# EAGLE design draft11_proto (EAGLE 6.3)
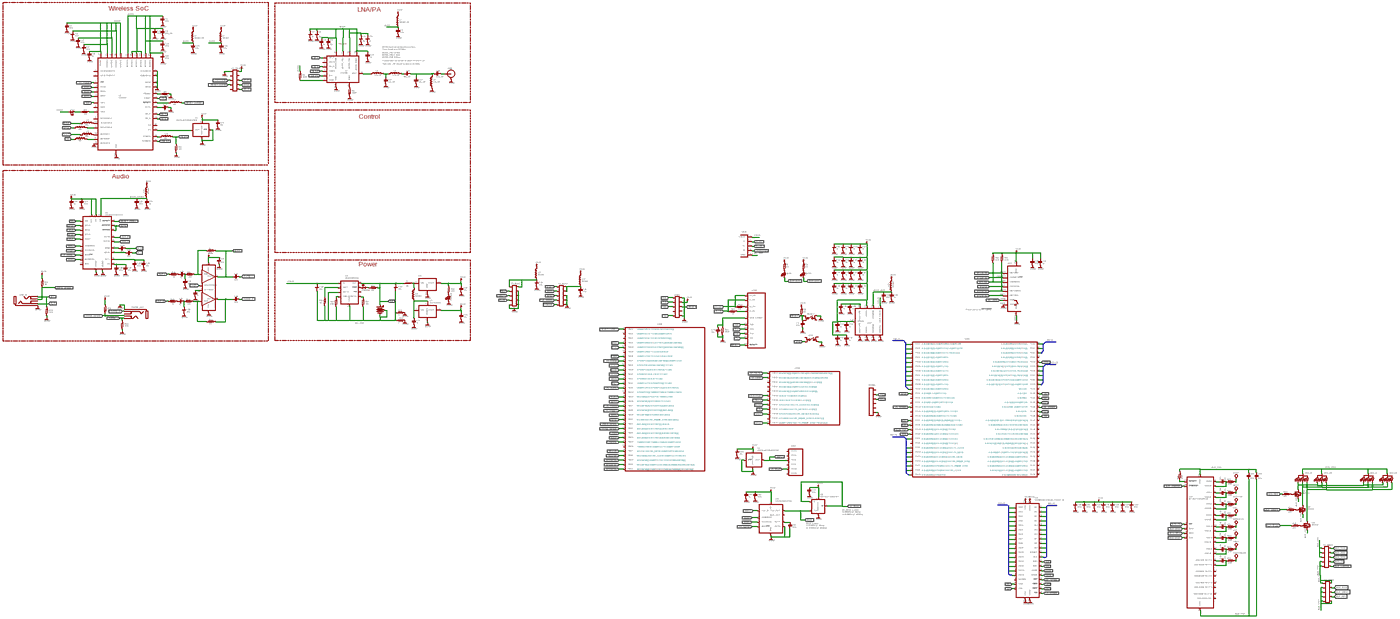
[diagram p0: schematic, sheet 1, overview]
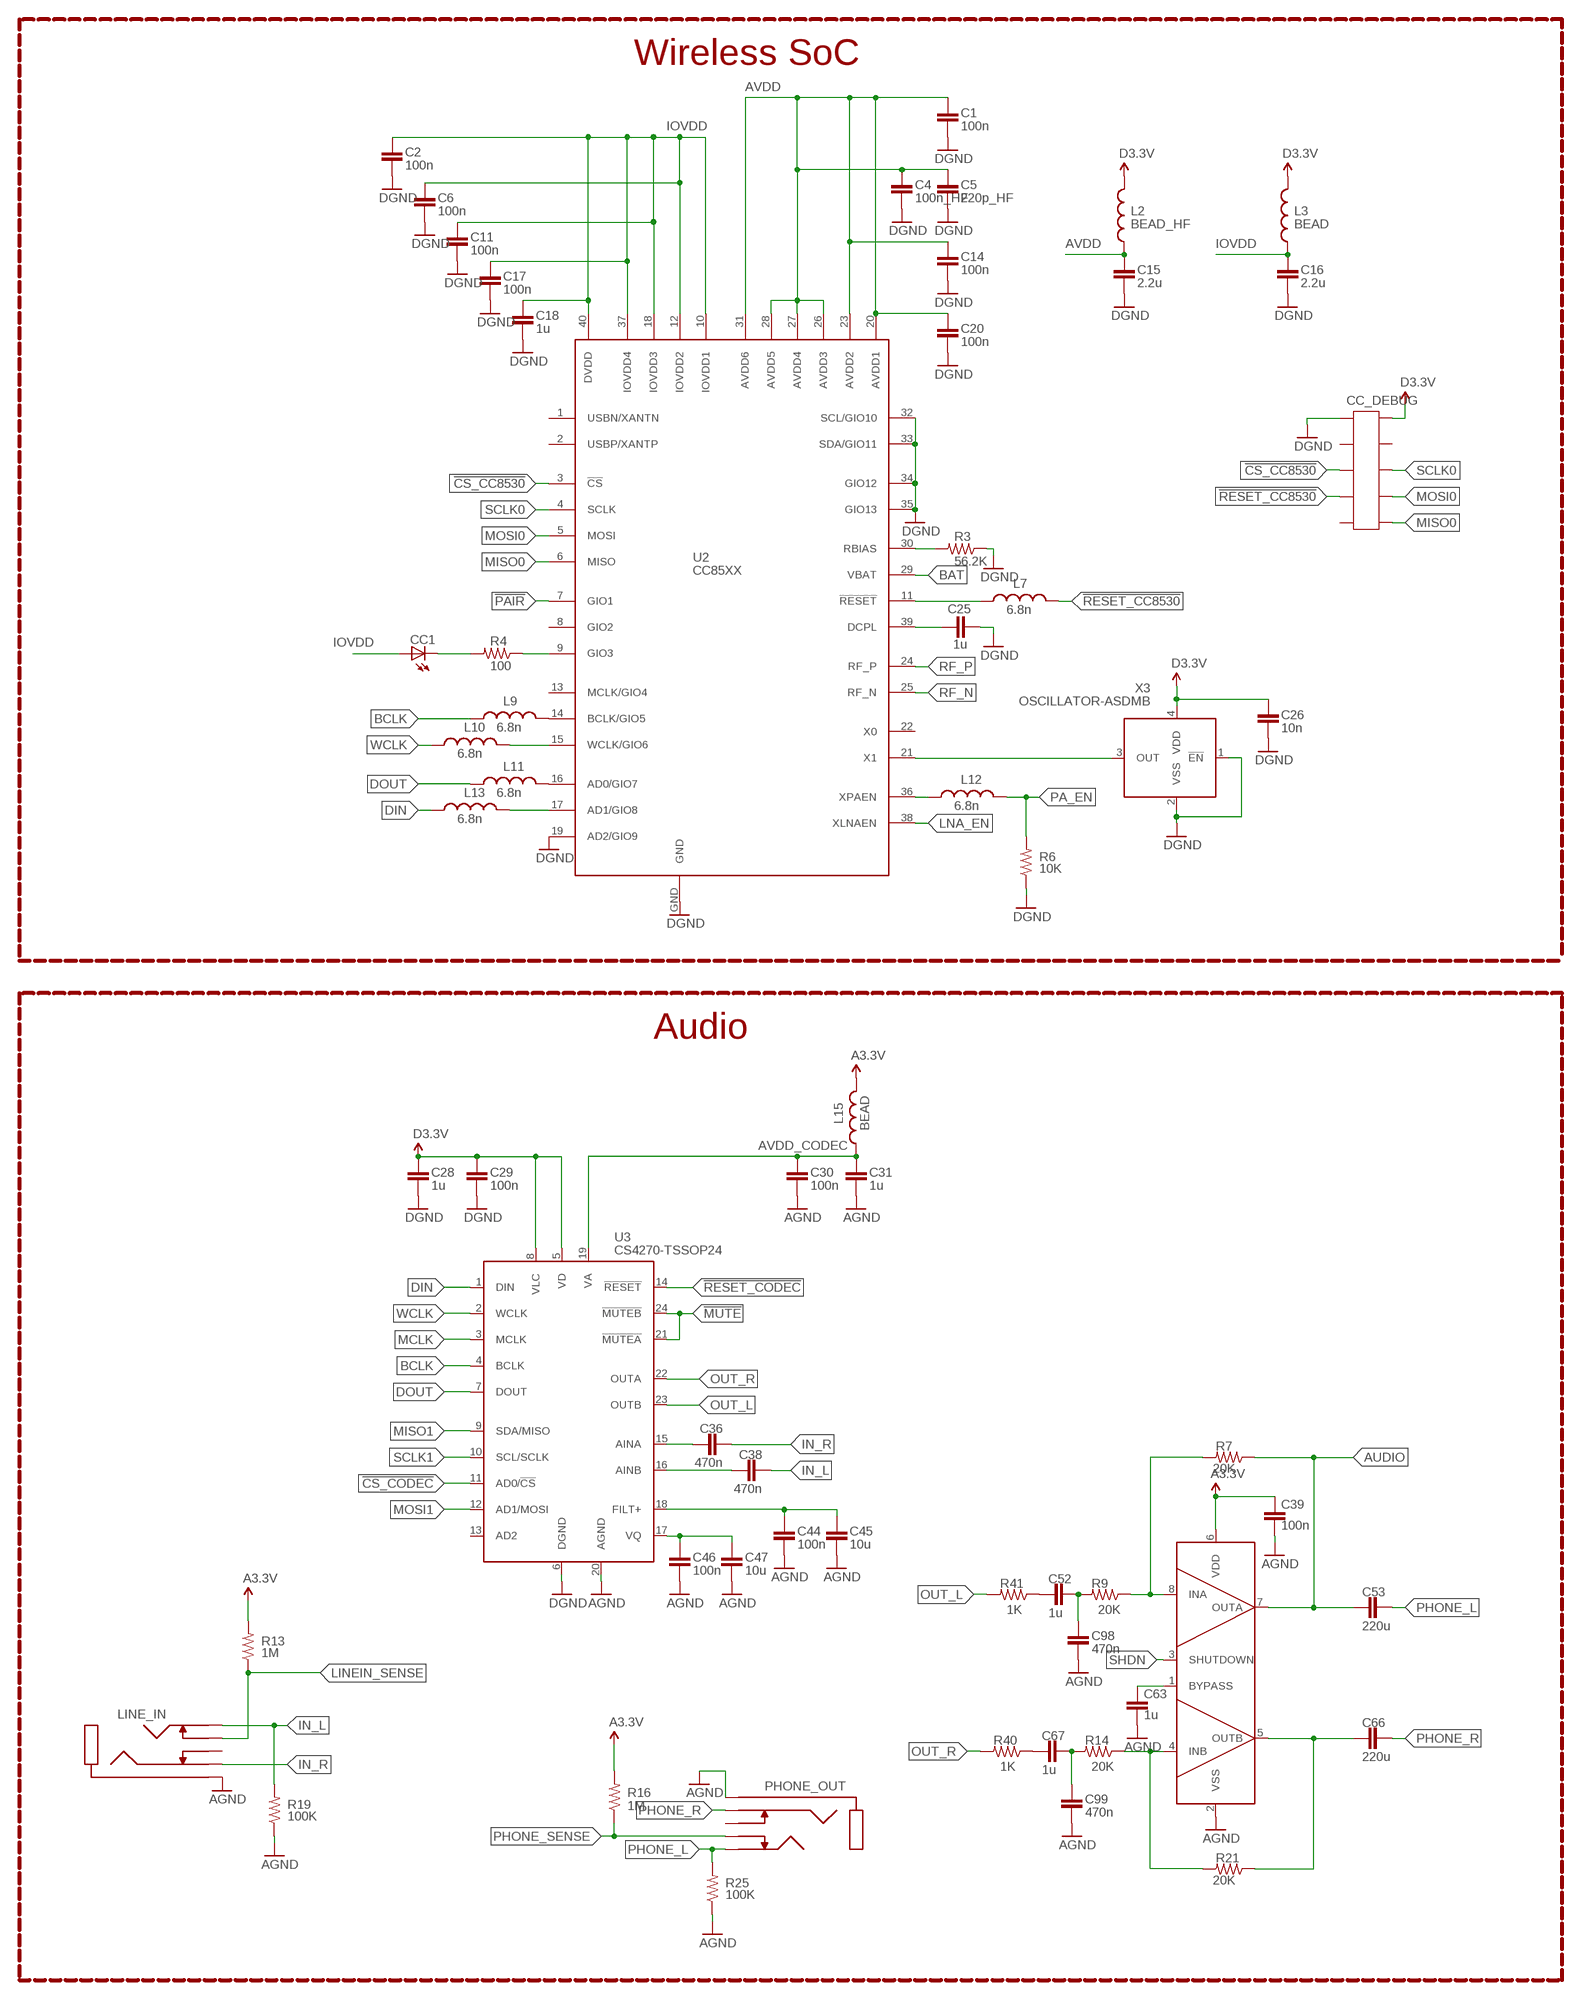
[diagram p1: schematic, sheet 1, part 1 of 4]
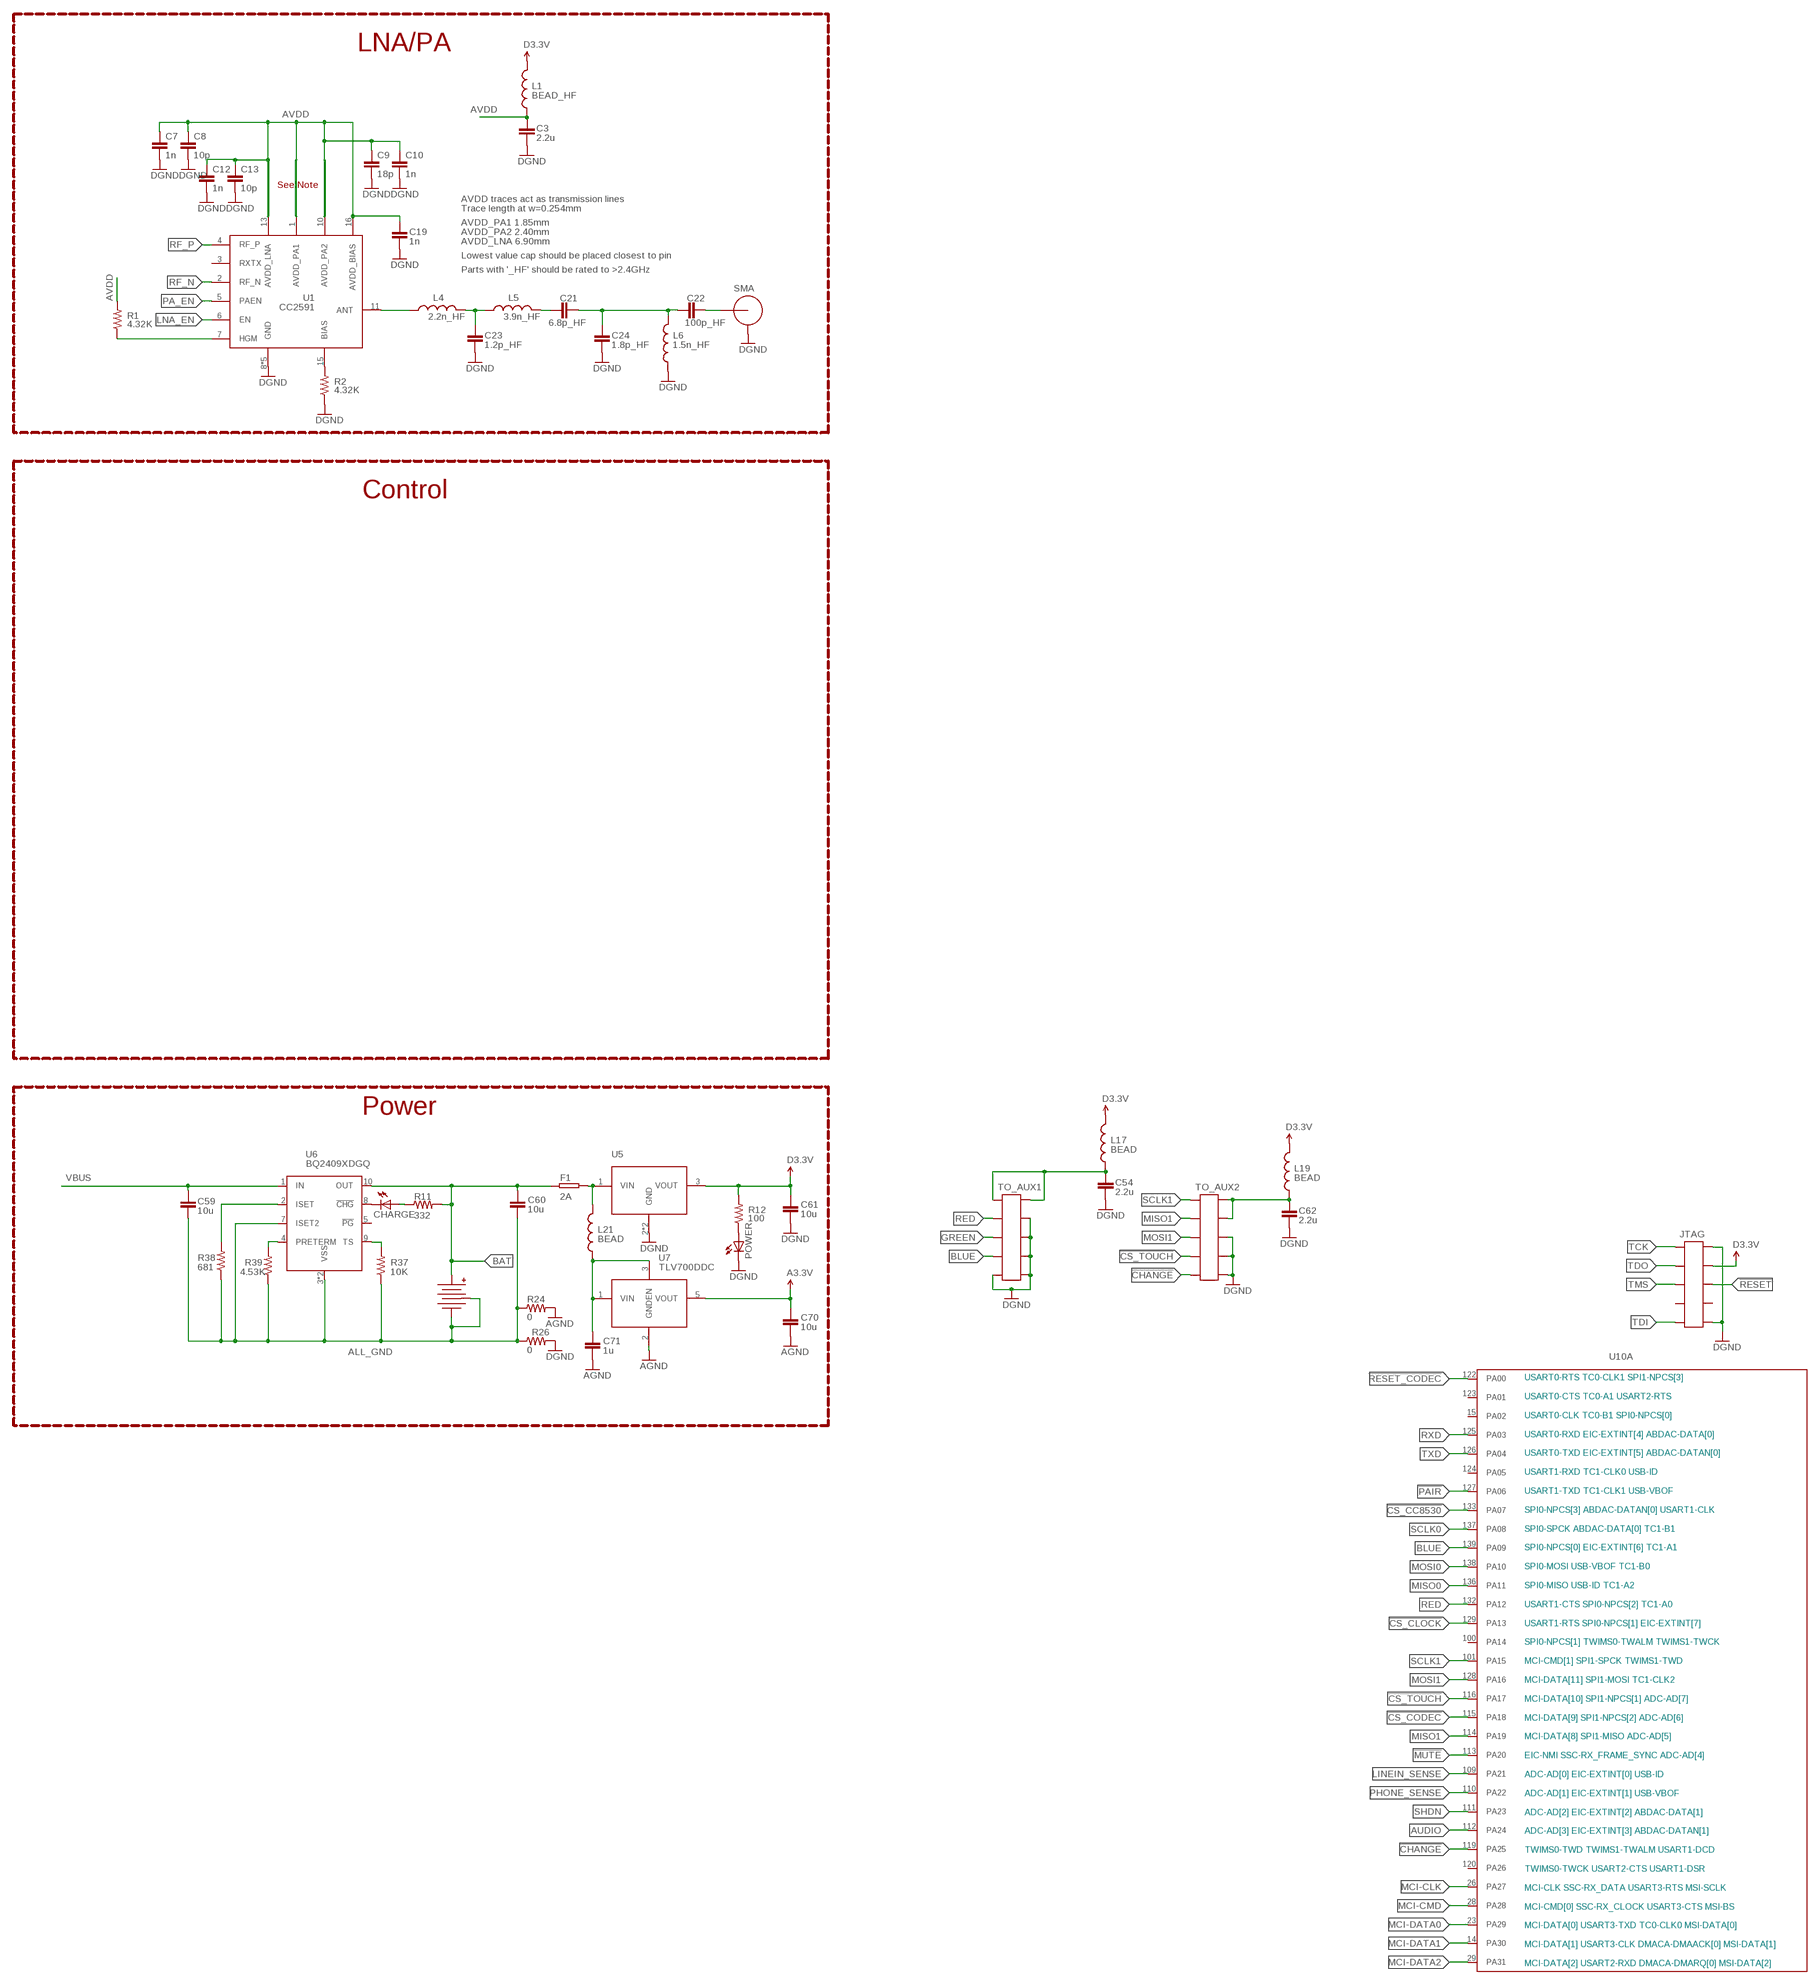
[diagram p2: schematic, sheet 1, part 2 of 4]
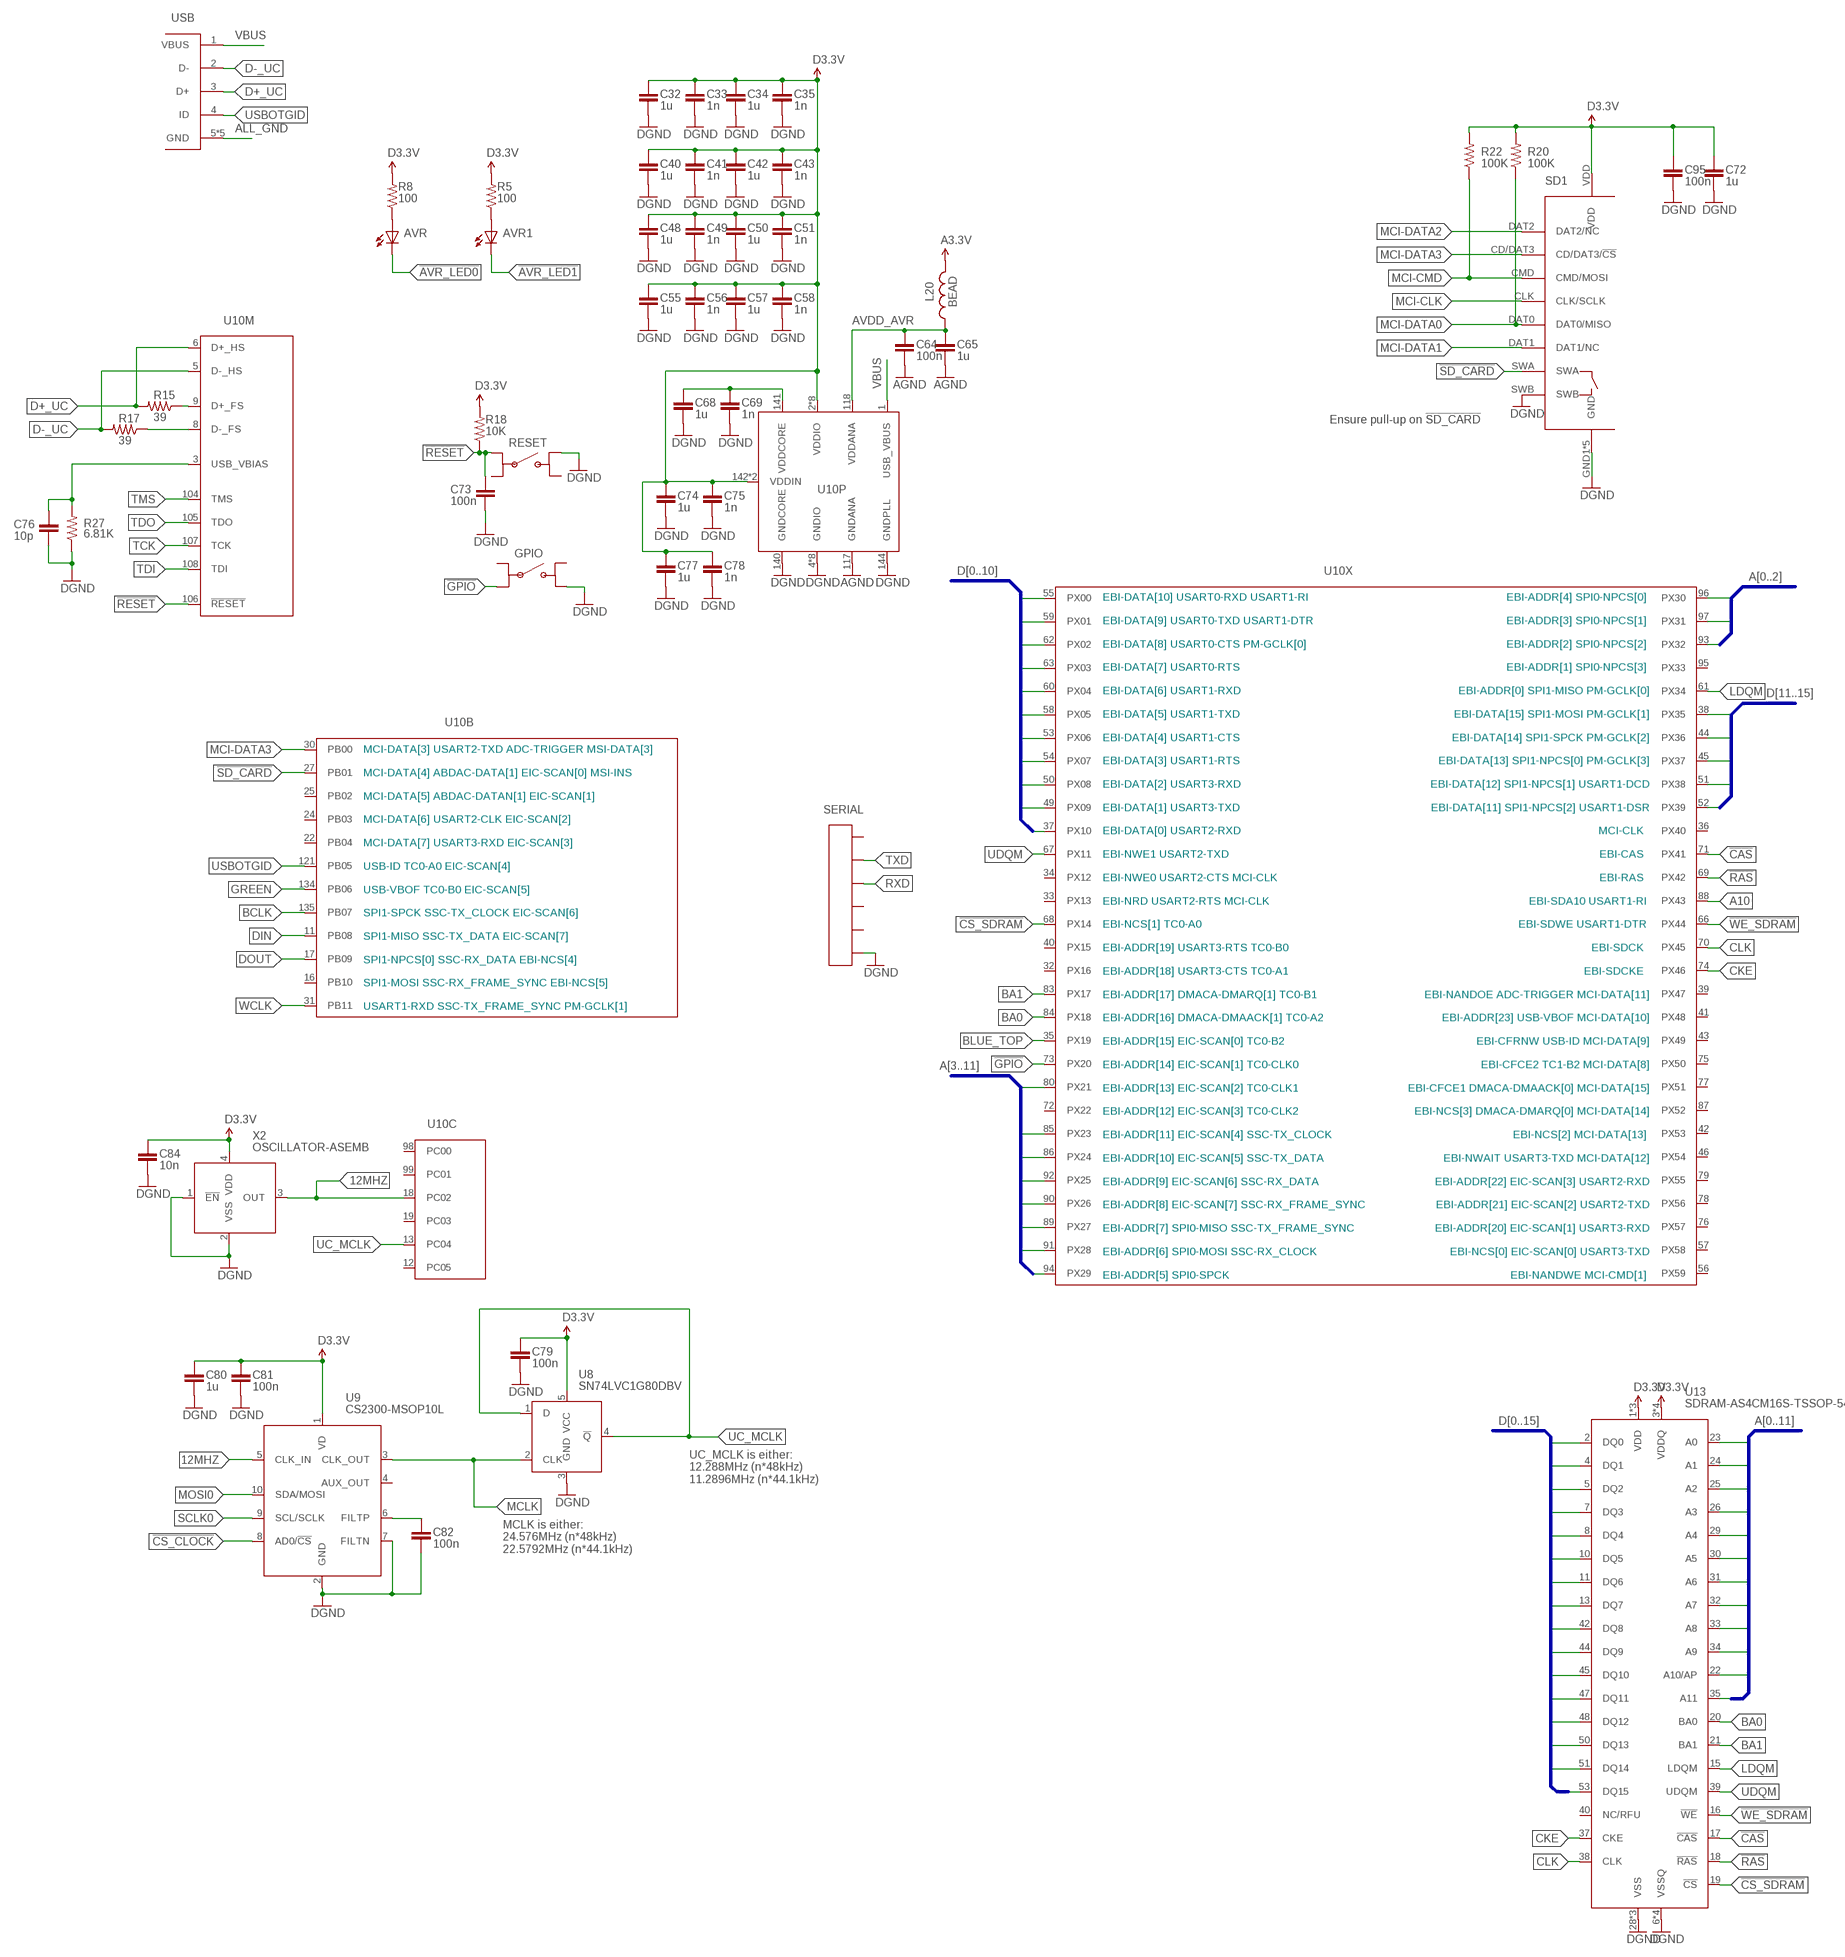
[diagram p3: schematic, sheet 1, part 3 of 4]
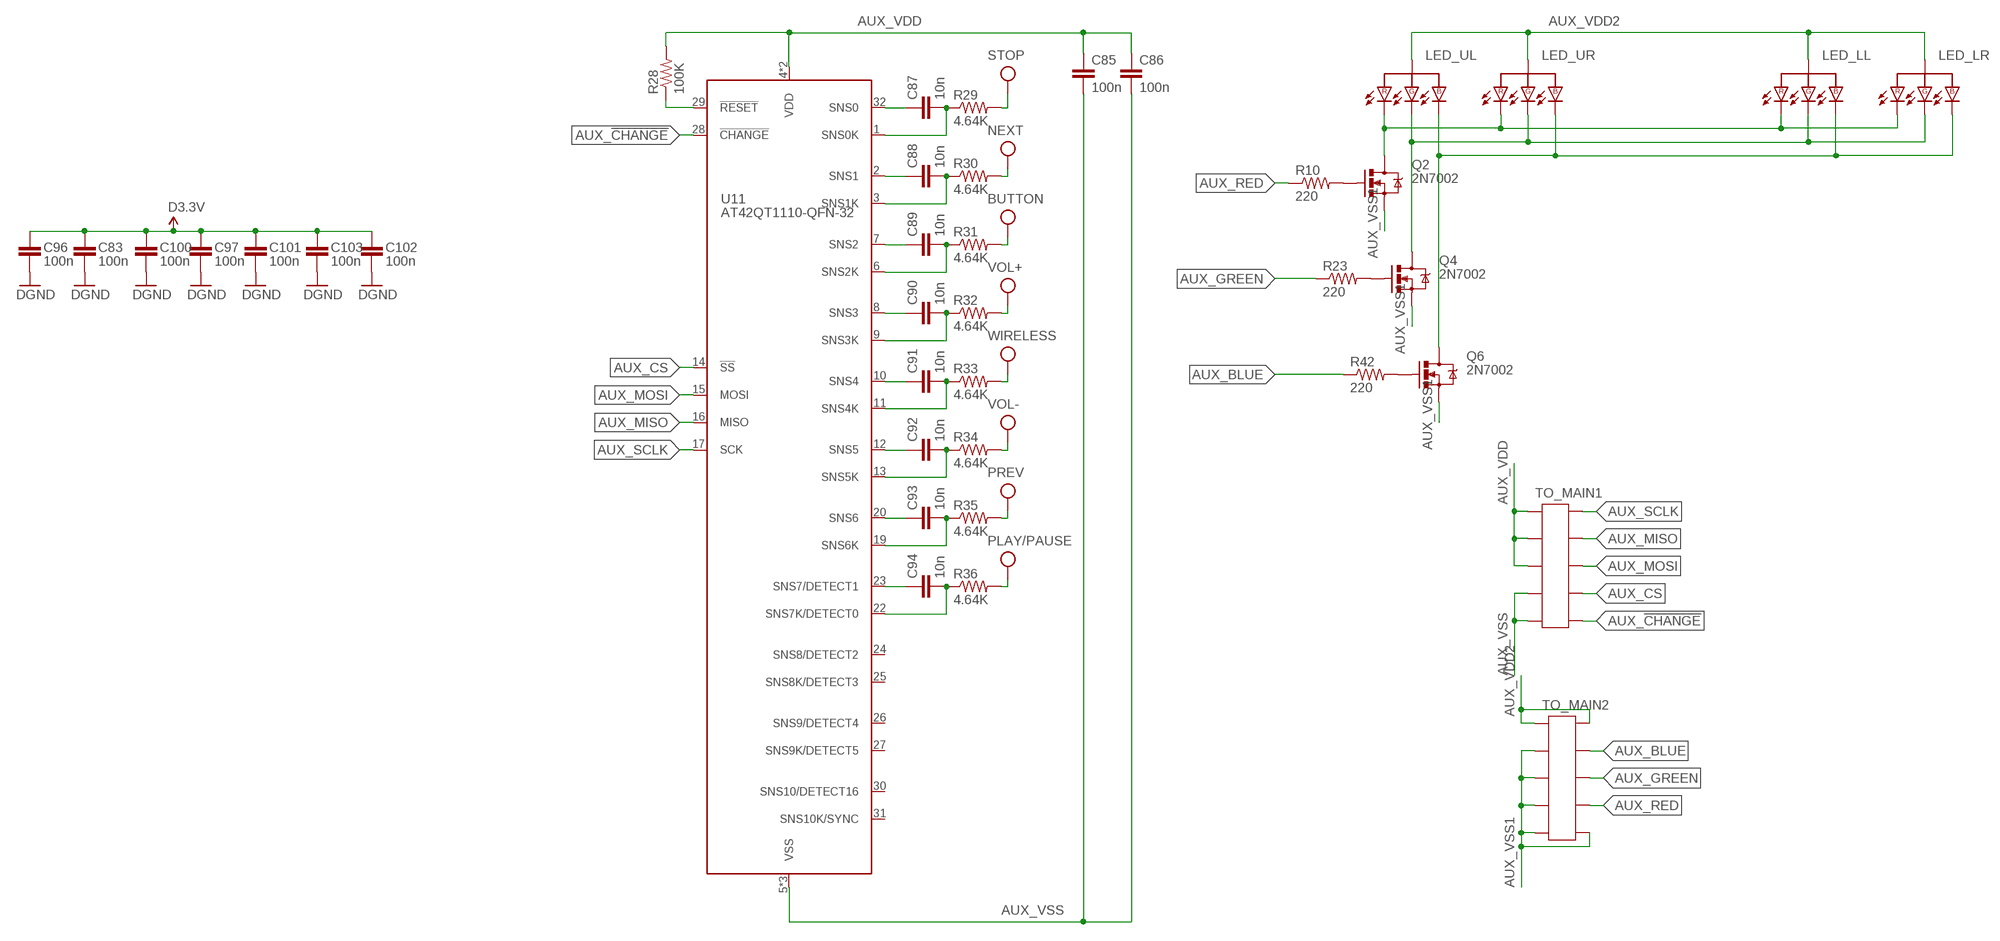
[diagram p4: schematic, sheet 1, part 4 of 4]

## Parts
AVR  LED1206  [LED-1206]
AVR1  LED1206  [LED-1206]
BATTERY  BATTERY-LIPO-JST  [1775469-2]
BUTTON  TOUCH_PAD-CIRCLE-10MM  [TOUCH-CIRCLE-10MM]
C1  100n  C-EUC0603  [C0603]
C2  100n  C-EUC0603  [C0603]
C3  2.2u  C-EUC0603  [C0603]
C4  100n_HF  C-EUC0603  [C0603]
C5  220p_HF  C-EUC0603  [C0603]
C6  100n  C-EUC0603  [C0603]
C7  1n  C-EUC0603  [C0603]
C8  10p  C-EUC0603  [C0603]
C9  18p  C-EUC0603  [C0603]
C10  1n  C-EUC0603  [C0603]
C11  100n  C-EUC0603  [C0603]
C12  1n  C-EUC0603  [C0603]
C13  10p  C-EUC0603  [C0603]
C14  100n  C-EUC0603  [C0603]
C15  2.2u  C-EUC0603  [C0603]
C16  2.2u  C-EUC0603  [C0603]
C17  100n  C-EUC0603  [C0603]
C18  1u  C-EUC0603  [C0603]
C19  1n  C-EUC0603  [C0603]
C20  100n  C-EUC0603  [C0603]
C21  6.8p_HF  C-EUC0603  [C0603]
C22  100p_HF  C-EUC0603  [C0603]
C23  1.2p_HF  C-EUC0603  [C0603]
C24  1.8p_HF  C-EUC0603  [C0603]
C25  1u  C-EUC0603  [C0603]
C26  10n  C-EUC0603  [C0603]
C28  1u  C-EUC0603  [C0603]
C29  100n  C-EUC0603  [C0603]
C30  100n  C-EUC0603  [C0603]
C31  1u  C-EUC0603  [C0603]
C32  1u  C-EUC0603  [C0603]
C33  1n  C-EUC0603  [C0603]
C34  1u  C-EUC0603  [C0603]
C35  1n  C-EUC0603  [C0603]
C36  470n  C-EUC0603  [C0603]
C38  470n  C-EUC0603  [C0603]
C39  100n  C-EUC0603  [C0603]
C40  1u  C-EUC0603  [C0603]
C41  1n  C-EUC0603  [C0603]
C42  1u  C-EUC0603  [C0603]
C43  1n  C-EUC0603  [C0603]
C44  100n  C-EUC0603  [C0603]
C45  10u  C-EUC0603  [C0603]
C46  100n  C-EUC0603  [C0603]
C47  10u  C-EUC0603  [C0603]
C48  1u  C-EUC0603  [C0603]
C49  1n  C-EUC0603  [C0603]
C50  1u  C-EUC0603  [C0603]
C51  1n  C-EUC0603  [C0603]
C52  1u  C-EUC0603  [C0603]
C53  220u  C-EUC1210  [C1210]
C54  2.2u  C-EUC0603  [C0603]
C55  1u  C-EUC0603  [C0603]
C56  1n  C-EUC0603  [C0603]
C57  1u  C-EUC0603  [C0603]
C58  1n  C-EUC0603  [C0603]
C59  10u  C-EUC0603  [C0603]
C60  10u  C-EUC0603  [C0603]
C61  10u  C-EUC0603  [C0603]
C62  2.2u  C-EUC0603  [C0603]
C63  1u  C-EUC0603  [C0603]
C64  100n  C-EUC0603  [C0603]
C65  1u  C-EUC0603  [C0603]
C66  220u  C-EUC1210  [C1210]
C67  1u  C-EUC0603  [C0603]
C68  1u  C-EUC0603  [C0603]
C69  1n  C-EUC0603  [C0603]
C70  10u  C-EUC0603  [C0603@1]
C71  1u  C-EUC0603  [C0603]
C72  1u  C-EUC0603  [C0603]
C73  100n  C-EUC0603  [C0603]
C74  1u  C-EUC0603  [C0603]
C75  1n  C-EUC0603  [C0603]
C76  10p  C-EUC0603  [C0603]
C77  1u  C-EUC0603  [C0603]
C78  1n  C-EUC0603  [C0603]
C79  100n  C-EUC0603  [C0603]
C80  1u  C-EUC0603  [C0603]
C81  100n  C-EUC0603  [C0603]
C82  100n  C-EUC0603  [C0603]
C83  100n  C-EUC0603  [C0603]
C84  10n  C-EUC0603  [C0603]
C85  100n  C-EUC0603  [C0603]
C86  100n  C-EUC0603  [C0603]
C87  10n  C-EUC0603  [C0603]
C88  10n  C-EUC0603  [C0603]
C89  10n  C-EUC0603  [C0603]
C90  10n  C-EUC0603  [C0603]
C91  10n  C-EUC0603  [C0603]
C92  10n  C-EUC0603  [C0603]
C93  10n  C-EUC0603  [C0603]
C94  10n  C-EUC0603  [C0603]
C95  100n  C-EUC0603  [C0603]
C96  100n  C-EUC0603  [C0603]
C97  100n  C-EUC0603  [C0603]
C98  470n  C-EUC0603  [C0603]
C99  470n  C-EUC0603  [C0603]
C100  100n  C-EUC0603  [C0603]
C101  100n  C-EUC0603  [C0603]
C102  100n  C-EUC0603  [C0603]
C103  100n  C-EUC0603  [C0603]
CC1  LED1206  [LED-1206]
CC_DEBUG  HEADER-10P-SMD-MALE2  [HEADER-10P-1.27MM]
CHARGE  LED1206  [LED-1206]
F1  2A  PTC_FUSE  [1210]
GPIO  TACT_SWITCH-PTS-525  [PTS-525]
JTAG  HEADER-10P-SMD-MALE2  [HEADER-10P-1.27MM]
L1  BEAD_HF  INDUCTOR0603  [0603]
L2  BEAD_HF  INDUCTOR0603  [0603]
L3  BEAD  INDUCTOR0603  [0603]
L4  2.2n_HF  INDUCTOR0603  [0603]
L5  3.9n_HF  INDUCTOR0603  [0603]
L6  1.5n_HF  INDUCTOR0603  [0603]
L7  6.8n  INDUCTOR0603  [0603]
L9  6.8n  INDUCTOR0603  [0603]
L10  6.8n  INDUCTOR0603  [0603]
L11  6.8n  INDUCTOR0603  [0603]
L12  6.8n  INDUCTOR0603  [0603@1]
L13  6.8n  INDUCTOR0603  [0603]
L15  BEAD  INDUCTOR0603  [0603@1]
L17  BEAD  INDUCTOR0603  [0603]
L19  BEAD  INDUCTOR0603  [0603]
L20  BEAD  INDUCTOR0603  [0603]
L21  BEAD  INDUCTOR0603  [0603]
LED_LL  LED_RGB  [PLCC-4]
LED_LR  LED_RGB  [PLCC-4]
LED_UL  LED_RGB  [PLCC-4]
LED_UR  LED_RGB  [PLCC-4]
LINE_IN  PHONE_SW-STX-35332-5N  [STX-35332-5N]
NEXT  TOUCH_PAD-CIRCLE-10MM  [TOUCH-CIRCLE-10MM]
PHONE_OUT  PHONE_SW-STX-35332-5N  [STX-35332-5N]
PLAY/PAUSE  TOUCH_PAD-CIRCLE-10MM  [TOUCH-CIRCLE-10MM]
POWER  LED1206  [LED-1206]
PREV  TOUCH_PAD-CIRCLE-10MM  [TOUCH-CIRCLE-10MM]
Q2  2N7002  MOSFET-NCHANNELSMD  [SOT23-3]
Q4  2N7002  MOSFET-NCHANNELSMD  [SOT23-3]
Q6  2N7002  MOSFET-NCHANNELSMD  [SOT23-3]
R1  4.32K  R-US_R0603  [R0603]
R2  4.32K  R-US_R0603  [R0603]
R3  56.2K  R-US_R0603  [R0603]
R4  100  R-US_R0603  [R0603]
R5  100  R-US_R0603  [R0603]
R6  10K  R-US_R0603  [R0603]
R7  20K  R-US_R0603  [R0603]
R8  100  R-US_R0603  [R0603]
R9  20K  R-US_R0603  [R0603]
R10  220  R-US_R0603  [R0603]
R11  332  R-US_R0603  [R0603]
R12  100  R-US_R0603  [R0603]
R13  1M  R-US_R0603  [R0603]
R14  20K  R-US_R0603  [R0603]
R15  39  R-US_R0603  [R0603]
R16  1M  R-US_R0603  [R0603]
R17  39  R-US_R0603  [R0603]
R18  10K  R-US_R0603  [R0603]
R19  100K  R-US_R0603  [R0603]
R20  100K  R-US_R0603  [R0603]
R21  20K  R-US_R0603  [R0603]
R22  100K  R-US_R0603  [R0603]
R23  220  R-US_R0603  [R0603]
R24  0  R-US_R0603  [R0603]
R25  100K  R-US_R0603  [R0603]
R26  0  R-US_R0603  [R0603]
R27  6.81K  R-US_R0603  [R0603]
R28  100K  R-US_R0603  [R0603]
R29  4.64K  R-US_R0603  [R0603]
R30  4.64K  R-US_R0603  [R0603]
R31  4.64K  R-US_R0603  [R0603]
R32  4.64K  R-US_R0603  [R0603]
R33  4.64K  R-US_R0603  [R0603]
R34  4.64K  R-US_R0603  [R0603]
R35  4.64K  R-US_R0603  [R0603]
R36  4.64K  R-US_R0603  [R0603]
R37  10K  R-US_R0603  [R0603]
R38  681  R-US_R0603  [R0603]
R39  4.53K  R-US_R0603  [R0603]
R40  1K  R-US_R0603  [R0603]
R41  1K  R-US_R0603  [R0603]
R42  220  R-US_R0603  [R0603]
RESET  TACT_SWITCH-PTS-525  [PTS-525]
SD1  MICROSD104031-0811  [MOLEX_104031-0811]
SERIAL  HEADER-6X1-961106-5500  [HEADER-3M-961-6P-2.54MM]
SMA  SMA-REVSMA-0.62  [CONREVSMA003.062]
STOP  TOUCH_PAD-CIRCLE-10MM  [TOUCH-CIRCLE-10MM]
TO_AUX1  HEADER-10P-SMD-2MM-FEMALE  [M22-63405]
TO_AUX2  HEADER-10P-SMD-2MM-FEMALE  [M22-63405]
TO_MAIN1  HEADER-10P-SMD-2MM-MALE  [M22-53205]
TO_MAIN2  HEADER-10P-SMD-2MM-MALE  [M22-53205]
U1  CC2591  [S-PVQFN-N16]
U2  CC85XX  [S-PVQFN-N40]
U3  CS4270-TSSOP24  [TSSOP-24L]
U4  LM4881  [SO08]
U5  MCP1826-SOT223  [SOT-223]
U6  BQ2409XDGQ  [S-PDSO-G10]
U7  TLV700DDC  [SOT-23-5]
U8  SN74LVC1G80DBV  [SOT-23-5]
U9  CS2300-MSOP10L  [MSOP-10L]
U10  AT32UC3A3-LQFP-144  [LQFP-144]
U11  AT42QT1110-QFN-32  [QFN-32]
U13  SDRAM-AS4CM16S-TSSOP-54  [TSSOP-54]
USB  USB_MICRO_AB  [USB_MICRO_AB]
VOL+  TOUCH_PAD-CIRCLE-10MM  [TOUCH-CIRCLE-10MM]
VOL-  TOUCH_PAD-CIRCLE-10MM  [TOUCH-CIRCLE-10MM]
WIRELESS  TOUCH_PAD-CIRCLE-10MM  [TOUCH-CIRCLE-10MM]
X2  OSCILLATOR-ASEMB  [ASEMB]
X3  OSCILLATOR-ASDMB  [ASDMB]

## Nets
12MHZ: U9.5(CLK_IN) U10.18(C:PC02) X2.3(OUT)
!AVR_LED0: AVR.C
!AVR_LED1: AVR1.C
!CAS: U10.71(X:PX41) U13.17(!CAS)
!CHANGE: TO_AUX2.9 U10.119(A:PA25)
!CS_CC8530: CC_DEBUG.5 U2.3(!CS) U10.133(A:PA07)
!CS_CLOCK: U9.8(AD0/!CS) U10.129(A:PA13)
!CS_CODEC: U3.11(AD0/!CS) U10.115(A:PA18)
!CS_SDRAM: U10.68(X:PX14) U13.19(!CS)
!CS_TOUCH: TO_AUX2.7 U10.116(A:PA17)
!GPIO: GPIO.2 U10.73(X:PX20)
!MUTE: U3.21(!MUTEA) U3.24(!MUTEB) U10.113(A:PA20)
!PAIR: U2.7(GIO1) U10.127(A:PA06)
!RAS: U10.69(X:PX42) U13.18(!RAS)
!RESET: C73.1 JTAG.6 R18.1 RESET.1 U10.106(M:!RESET)
!RESET_CC8530: CC_DEBUG.7 L7.2
!RESET_CODEC: U3.14(!RESET) U10.122(A:PA00)
!SD_CARD: SD1.SWA U10.27(B:PB01)
!WE_SDRAM: U10.66(X:PX44) U13.16(!WE)
A0: U10.93(X:PX32) U13.23(A0)
A1: U10.97(X:PX31) U13.24(A1)
A2: U10.96(X:PX30) U13.25(A2)
A3: U10.94(X:PX29) U13.26(A3)
A3.3V: C39.1 C70.1 L15.2 L20.2 R13.2 R16.2 U4.6(VDD) U7.5(VOUT)
A4: U10.91(X:PX28) U13.29(A4)
A5: U10.89(X:PX27) U13.30(A5)
A6: U10.90(X:PX26) U13.31(A6)
A7: U10.92(X:PX25) U13.32(A7)
A8: U10.86(X:PX24) U13.33(A8)
A9: U10.85(X:PX23) U13.34(A9)
A10: U10.88(X:PX43) U13.22(A10/AP)
A11: U10.80(X:PX21) U13.35(A11)
AGND [Analog]: C30.2 C31.2 C39.2 C44.2 C45.2 C46.2 C47.2 C63.2 C64.2 C65.2 C70.2 C71.2 C98.2 C99.2 LINE_IN.5(GND) PHONE_OUT.5(GND) R19.1 R24.2 R25.1 U3.20(AGND) U4.2(VSS) U7.2(GND) U10.117(P:GNDANA)
ALL_GND [Power]: BATTERY.-(N) BATTERY.X1(CASE) BATTERY.X2(CASE) C59.2 C60.2 R24.1 R26.1 R37.1 R38.1 R39.1 U6.3(VSS) U6.7(ISET2) U6.GND(VSS) USB.5(GND) USB.GND1(GND) USB.GND2(GND) USB.GND3(GND) USB.GND4(GND)
AUDIO: C53.1 R7.1 U4.7(OUTA) U10.112(A:PA24)
AUX_!CHANGE: TO_MAIN1.10 U11.28(!CHANGE)
AUX_BLUE: R42.1 TO_MAIN2.4
AUX_CS: TO_MAIN1.8 U11.14(!SS)
AUX_GREEN: R23.1 TO_MAIN2.6
AUX_MISO: TO_MAIN1.4 U11.16(MISO)
AUX_MOSI: TO_MAIN1.6 U11.15(MOSI)
AUX_RED: R10.1 TO_MAIN2.8
AUX_SCLK: TO_MAIN1.2 U11.17(SCK)
AUX_VDD: C85.1 C86.1 R28.2 TO_MAIN1.1 TO_MAIN1.3 TO_MAIN1.5 U11.4(VDD) U11.18(VDD)
AUX_VDD2: LED_LL.2(A) LED_LL.2-2(A) LED_LR.2(A) LED_LR.2-2(A) LED_UL.2(A) LED_UL.2-2(A) LED_UR.2(A) LED_UR.2-2(A) TO_MAIN2.1 TO_MAIN2.2
AUX_VSS: C85.2 C86.2 TO_MAIN1.7 TO_MAIN1.9 U11.5(VSS) U11.21(VSS) U11.GND(VSS)
AUX_VSS1: Q2.2(S) Q4.2(S) Q6.2(S) TO_MAIN2.3 TO_MAIN2.5 TO_MAIN2.7 TO_MAIN2.9 TO_MAIN2.10
AVDD: C1.1 C3.1 C4.1 C5.1 C7.1 C8.1 C9.1 C10.1 C12.1 C13.1 C14.1 C15.1 C19.1 C20.1 L1.1 L2.1 R1.2 U1.1(AVDD_PA1) U1.10(AVDD_PA2) U1.13(AVDD_LNA) U1.16(AVDD_BIAS) U2.20(AVDD1) U2.23(AVDD2) U2.26(AVDD3) U2.27(AVDD4) U2.28(AVDD5) U2.31(AVDD6)
AVDD_AVR: C64.1 C65.1 L20.1 U10.118(P:VDDANA)
AVDD_CODEC: C30.1 C31.1 L15.1 U3.19(VA)
BA0: U10.84(X:PX18) U13.20(BA0)
BA1: U10.83(X:PX17) U13.21(BA1)
BAT [Power]: BATTERY.+(P) C60.1 F1.1 R11.2 U2.29(VBAT) U6.10(OUT)
BCLK: L9.1 U3.4(BCLK) U10.135(B:PB07)
BLUE: TO_AUX1.7 U10.139(A:PA09)
BLUE_TOP: U10.35(X:PX19)
CKE: U10.74(X:PX46) U13.37(CKE)
CLK: U10.70(X:PX45) U13.38(CLK)
D0: U10.37(X:PX10) U13.2(DQ0)
D1: U10.49(X:PX09) U13.4(DQ1)
D2: U10.50(X:PX08) U13.5(DQ2)
D3: U10.54(X:PX07) U13.7(DQ3)
D3.3V: C26.1 C28.1 C29.1 C32.1 C33.1 C34.1 C35.1 C40.1 C41.1 C42.1 C43.1 C48.1 C49.1 C50.1 C51.1 C55.1 C56.1 C57.1 C58.1 C61.1 C72.1 C74.1 C75.1 C77.1 C78.1 C79.1 C80.1 C81.1 C83.1 C84.1 C95.1 C96.1 C97.1 C100.1 C101.1 C102.1 C103.1 CC_DEBUG.2 JTAG.4 L1.2 L2.2 L3.2 L17.2 L19.2 R5.2 R8.2 R12.2 R18.2 R20.2 R22.2 SD1.VDD U3.5(VD) U3.8(VLC) U5.3(VOUT) U8.5(VCC) U9.1(VD) U10.2(P:VDDIO) U10.10(P:VDDIO) U10.21(P:VDDIO) U10.48(P:VDDIO) U10.64(P:VDDIO) U10.81(P:VDDIO) U10.103(P:VDDIO) U10.130(P:VDDIO) U10.142(P:VDDIN) U10.143(P:VDDIN) U13.1(VDD) U13.3(VDDQ) U13.9(VDDQ) U13.14(VDD) U13.27(VDD) U13.43(VDDQ) U13.49(VDDQ) X2.4(VDD) X3.4(VDD)
D4: U10.53(X:PX06) U13.8(DQ4)
D5: U10.58(X:PX05) U13.10(DQ5)
D6: U10.60(X:PX04) U13.11(DQ6)
D7: U10.63(X:PX03) U13.13(DQ7)
D8: U10.62(X:PX02) U13.42(DQ8)
D9: U10.59(X:PX01) U13.44(DQ9)
D10: U10.55(X:PX00) U13.45(DQ10)
D11: U10.52(X:PX39) U13.47(DQ11)
D12: U10.51(X:PX38) U13.48(DQ12)
D13: U10.45(X:PX37) U13.50(DQ13)
D14: U10.44(X:PX36) U13.51(DQ14)
D15: U10.38(X:PX35) U13.53(DQ15)
D+_UC: R15.2 U10.6(M:D+_HS) USB.3(D+)
D-_UC: R17.2 U10.5(M:D-_HS) USB.2(D-)
DGND: C1.2 C2.2 C3.2 C4.2 C5.2 C6.2 C7.2 C8.2 C9.2 C10.2 C11.2 C12.2 C13.2 C14.2 C15.2 C16.2 C17.2 C18.2 C19.2 C20.2 C23.2 C24.2 C25.2 C26.2 C28.2 C29.2 C32.2 C33.2 C34.2 C35.2 C40.2 C41.2 C42.2 C43.2 C48.2 C49.2 C50.2 C51.2 C54.2 C55.2 C56.2 C57.2 C58.2 C61.2 C62.2 C68.2 C69.2 C72.2 C73.2 C74.2 C75.2 C76.2 C77.2 C78.2 C79.2 C80.2 C81.2 C82.2 C83.2 C84.2 C95.2 C96.2 C97.2 C100.2 C101.2 C102.2 C103.2 CC_DEBUG.1 GPIO.4 JTAG.2 JTAG.10 L6.1 POWER.C R2.1 R3.1 R6.1 R26.2 R27.1 RESET.3 SD1.GND1(GND) SD1.GND2(GND) SD1.GND3(GND) SD1.GND4(GND) SD1.SWB SD1.VSS(GND) SERIAL.6 SMA.GND1(GND) SMA.GND2(GND) SMA.GND3(GND) SMA.GND4(GND) TO_AUX1.4 TO_AUX1.6 TO_AUX1.8 TO_AUX1.9 TO_AUX1.10 TO_AUX2.6 TO_AUX2.8 TO_AUX2.10 U1.8(GND) U1.9(GND) U1.12(GND) U1.14(GND) U1.GND U2.19(AD2/GIO9) U2.32(SCL/GIO10) U2.33(SDA/GIO11) U2.34(GIO12) U2.35(GIO13) U2.GND U3.6(DGND) U5.2(GND) U5.4(GND) U8.3(GND) U9.2(GND) U9.7(FILTN) U10.4(P:GNDIO) U10.7(P:GNDIO) U10.20(P:GNDIO) U10.47(P:GNDIO) U10.65(P:GNDIO) U10.82(P:GNDIO) U10.102(P:GNDIO) U10.131(P:GNDIO) U10.140(P:GNDCORE) U10.144(P:GNDPLL) U13.6(VSSQ) U13.12(VSSQ) U13.28(VSS) U13.41(VSS) U13.46(VSSQ) U13.52(VSSQ) U13.54(VSS) X2.1(!EN) X2.2(VSS) X3.1(!EN) X3.2(VSS)
DIN: L13.1 U3.1(DIN) U10.11(B:PB08)
DOUT: L11.1 U3.7(DOUT) U10.17(B:PB09)
GREEN: TO_AUX1.5 U10.134(B:PB06)
IN_L: C38.1 LINE_IN.4(L) R19.2
IN_R: C36.1 LINE_IN.1(R)
IOVDD: C2.1 C6.1 C11.1 C16.1 C17.1 C18.1 CC1.A L3.1 U2.10(IOVDD1) U2.12(IOVDD2) U2.18(IOVDD3) U2.37(IOVDD4) U2.40(DVDD)
LDQM: U10.61(X:PX34) U13.15(LDQM)
LINEIN_SENSE: LINE_IN.3(L_SW) R13.1 U10.109(A:PA21)
LNA_EN: U1.6(EN) U2.38(XLNAEN)
MCI-CLK: SD1.CLK(CLK/SCLK) U10.26(A:PA27)
MCI-CMD: R22.1 SD1.CMD(CMD/MOSI) U10.28(A:PA28)
MCI-DATA0: R20.1 SD1.DAT0(DAT0/MISO) U10.23(A:PA29)
MCI-DATA1: SD1.DAT1(DAT1/NC) U10.14(A:PA30)
MCI-DATA2: SD1.DAT2(DAT2/NC) U10.29(A:PA31)
MCI-DATA3: SD1.CD/DAT3(CD/DAT3/!CS) U10.30(B:PB00)
MCLK: U3.3(MCLK) U8.2(CLK) U9.3(CLK_OUT)
MISO0: CC_DEBUG.10 U2.6(MISO) U10.136(A:PA11)
MISO1: TO_AUX2.3 U3.9(SDA/MISO) U10.114(A:PA19)
MOSI0: CC_DEBUG.8 U2.5(MOSI) U9.10(SDA/MOSI) U10.138(A:PA10)
MOSI1: TO_AUX2.5 U3.12(AD1/MOSI) U10.128(A:PA16)
N$1: U2.21(X1) X3.3(OUT)
N$2: Q2.1(G) R10.2
N$3: L7.1 U2.11(!RESET)
N$4: L11.2 U2.16(AD0/GIO7)
N$5: L9.2 U2.14(BCLK/GIO5)
N$6: C94.2 R36.1 U11.22(SNS7K/DETECT0)
N$7: R2.2 U1.15(BIAS)
N$8: R1.1 U1.7(HGM)
N$9: C22.2 SMA.SIG
N$10: AVR1.A R5.1
N$11: PLAY/PAUSE.P$1 R36.2
N$12: AVR.A R8.1
N$13: L4.1 U1.11(ANT)
N$14: C23.1 L4.2 L5.1
N$15: C21.1 L5.2
N$16: C21.2 C22.1 C24.1 L6.2
N$17: C94.1 U11.23(SNS7/DETECT1)
N$18: L12.1 U2.36(XPAEN)
N$19: R3.2 U2.30(RBIAS)
N$20: C52.2 C98.1 R9.2
N$21: C25.1 U2.39(DCPL)
N$22: C71.1 L21.1 U7.1(VIN) U7.3(EN)
N$23: Q4.1(G) R23.2
N$24: C67.2 C99.1 R14.2
N$25: L10.2 U2.15(WCLK/GIO6)
N$26: C63.1 U4.1(BYPASS)
N$27: L13.2 U2.17(AD1/GIO8)
N$28: R4.1 U2.9(GIO3)
N$29: CC1.C R4.2
N$30: C90.2 R32.1 U11.9(SNS3K)
N$31: POWER.A R12.1
N$32: CHARGE.C U6.8(!CHG)
N$33: CHARGE.A R11.1
N$34: C68.1 C69.1 U10.141(P:VDDCORE)
N$35: Q6.1(G) R42.2
N$39: R17.1 U10.8(M:D-_FS)
N$40: C66.1 R21.1 U4.5(OUTB)
N$41: C91.2 R33.1 U11.11(SNS4K)
N$42: C92.2 R34.1 U11.13(SNS5K)
N$43: C87.2 R29.1 U11.1(SNS0K)
N$44: R38.2 U6.2(ISET)
N$45: C88.2 R30.1 U11.3(SNS1K)
N$46: R15.1 U10.9(M:D+_FS)
N$47: C76.1 R27.2 U10.3(M:USB_VBIAS)
N$49: C67.1 R40.1
N$50: F1.2 L21.2 U5.1(VIN)
N$51: C52.1 R41.1
N$53: R7.2 R9.1 U4.8(INA)
N$54: R14.1 R21.2 U4.4(INB)
N$56: LED_LL.1(KR) LED_LL.1-2(KR) LED_LR.1(KR) LED_LR.1-2(KR) LED_UL.1(KR) LED_UL.1-2(KR) LED_UR.1(KR) LED_UR.1-2(KR) Q2.3(D)
N$58: LED_LL.4(KG) LED_LL.4-2(KG) LED_LR.4(KG) LED_LR.4-2(KG) LED_UL.4(KG) LED_UL.4-2(KG) LED_UR.4(KG) LED_UR.4-2(KG) Q4.3(D)
N$59: C87.1 U11.32(SNS0)
N$60: C90.1 U11.8(SNS3)
N$61: R32.2 VOL+.P$1
N$62: C91.1 U11.10(SNS4)
N$63: R33.2 WIRELESS.P$1
N$64: C92.1 U11.12(SNS5)
N$65: R34.2 VOL-.P$1
N$66: R37.2 U6.9(TS)
N$67: C54.1 L17.1 TO_AUX1.1 TO_AUX1.2
N$69: R39.2 U6.4(PRETERM)
N$71: C93.2 R35.1 U11.19(SNS6K)
N$72: PREV.P$1 R35.2
N$76: C93.1 U11.20(SNS6)
N$77: R28.1 U11.29(!RESET)
N$78: LED_LL.3(KB) LED_LL.3-2(KB) LED_LR.3(KB) LED_LR.3-2(KB) LED_UL.3(KB) LED_UL.3-2(KB) LED_UR.3(KB) LED_UR.3-2(KB) Q6.3(D)
N$84: C62.1 L19.1 TO_AUX2.2 TO_AUX2.4
N$85: R29.2 STOP.P$1
N$86: C88.1 U11.2(SNS1)
N$87: NEXT.P$1 R30.2
N$88: C46.1 C47.1 U3.17(VQ)
N$89: C44.1 C45.1 U3.18(FILT+)
N$90: C89.2 R31.1 U11.6(SNS2K)
N$91 [Analog]: C36.2 U3.15(AINA)
N$92 [Analog]: C38.2 U3.16(AINB)
N$93: C89.1 U11.7(SNS2)
N$94: C82.1 U9.6(FILTP)
N$95: BUTTON.P$1 R31.2
OUT_L: R41.2 U3.23(OUTB)
OUT_R: R40.2 U3.22(OUTA)
PA_EN: L12.2 R6.2 U1.5(PAEN)
PHONE_L: C53.2 PHONE_OUT.4(L) R25.2
PHONE_R [Analog]: C66.2 PHONE_OUT.1(R)
PHONE_SENSE: PHONE_OUT.3(L_SW) R16.1 U10.110(A:PA22)
RED: TO_AUX1.3 U10.132(A:PA12)
RF_N: U1.2(RF_N) U2.25(RF_N)
RF_P: U1.4(RF_P) U2.24(RF_P)
RXD: SERIAL.3 U10.125(A:PA03)
SCLK0: CC_DEBUG.6 U2.4(SCLK) U9.9(SCL/SCLK) U10.137(A:PA08)
SCLK1: TO_AUX2.1 U3.10(SCL/SCLK) U10.101(A:PA15)
SHDN: U4.3(SHUTDOWN) U10.111(A:PA23)
TCK: JTAG.1 U10.107(M:TCK)
TDI: JTAG.9 U10.108(M:TDI)
TDO: JTAG.3 U10.105(M:TDO)
TMS: JTAG.5 U10.104(M:TMS)
TXD: SERIAL.2 U10.126(A:PA04)
UC_MCLK: U8.1(D) U8.4(!Q) U10.13(C:PC04)
UDQM: U10.67(X:PX11) U13.39(UDQM)
USBOTGID: U10.121(B:PB05) USB.4(ID)
VBUS [Power]: C59.1 U6.1(IN) U10.1(P:USB_VBUS) USB.1(VBUS)
WCLK: L10.1 U3.2(WCLK) U10.31(B:PB11)
Unconnected: CC_DEBUG.3 CC_DEBUG.4 CC_DEBUG.9 GPIO.1 GPIO.3 JTAG.7 JTAG.8 LINE_IN.2(R_SW) PHONE_OUT.2(R_SW) RESET.2 RESET.4 SERIAL.1 SERIAL.4 SERIAL.5 U1.3(RXTX) U2.1(USBN/XANTN) U2.2(USBP/XANTP) U2.8(GIO2) U2.13(MCLK/GIO4) U2.22(X0) U3.13(AD2) U6.5(!PG) U9.4(AUX_OUT) U10.12(C:PC05) U10.15(A:PA02) U10.16(B:PB10) U10.19(C:PC03) U10.22(B:PB04) U10.24(B:PB03) U10.25(B:PB02) U10.32(X:PX16) U10.33(X:PX13) U10.34(X:PX12) U10.36(X:PX40) U10.39(X:PX47) U10.40(X:PX15) U10.41(X:PX48) U10.42(X:PX53) U10.43(X:PX49) U10.46(X:PX54) U10.56(X:PX59) U10.57(X:PX58) U10.72(X:PX22) U10.75(X:PX50) U10.76(X:PX57) U10.77(X:PX51) U10.78(X:PX56) U10.79(X:PX55) U10.87(X:PX52) U10.95(X:PX33) U10.98(C:PC00) U10.99(C:PC01) U10.100(A:PA14) U10.120(A:PA26) U10.123(A:PA01) U10.124(A:PA05) U11.24(SNS8/DETECT2) U11.25(SNS8K/DETECT3) U11.26(SNS9/DETECT4) U11.27(SNS9K/DETECT5) U11.30(SNS10/DETECT16) U11.31(SNS10K/SYNC) U13.40(NC/RFU)

## Buses
A[0..11]
D[0..15]
A[3..11]
D[0..10]
D[11..15]
A[0..2]

## Notes on the sheet
- Wireless SoC | LNA/PA
- See Note
- AVDD traces act as transmission lines
- Trace length at w=0.254mm
- AVDD_PA1 1.85mm
- AVDD_PA2 2.40mm
- AVDD_LNA 6.90mm
- Lowest value cap should be placed closest to pin
- Parts with '_HF' should be rated to >2.4GHz
- Control
- Audio
- Power
- Ensure pull-up on !SD_CARD
- UC_MCLK is either:
  12.288MHz (n*48kHz)
  11.2896MHz (n*44.1kHz)
- MCLK is either:
  24.576MHz (n*48kHz)
  22.5792MHz (n*44.1kHz)

## Library data of the parts
AVR AVR1 CC1 CHARGE POWER = SparkFun-LED:LED: LEDs Standard schematic elements and footprints for 5mm, 3mm, 1206, and 0603 sized LEDs. 5mm - Spark Fun Electronics SKU : COM-00529 (and others)
BATTERY = 00-EvaLibrary:BATTERY
BUTTON NEXT PLAY/PAUSE PREV STOP VOL+ VOL- WIRELESS = 00-EvaLibrary:TOUCH_PAD
C1-C26 C28-C36 C38-C69 C71-C103 = 00-EvaLibrary:C-EU: CAPACITOR, European symbol
C70 = rcl:C-EU: CAPACITOR, European symbol
CC_DEBUG JTAG TO_AUX1 TO_AUX2 TO_MAIN1 TO_MAIN2 = 00-EvaLibrary:HEADER-10P
F1 = 00-EvaLibrary:PTC_FUSE
GPIO RESET = 00-EvaLibrary:TACT_SWITCH
L1-L7 L9-L11 L13 L17 L19-L21 = 00-EvaLibrary:INDUCTOR: Inductors Basic Inductor/Choke - 0603 and 1206. Footprints are not proven and vary greatly between part numbers.
L12 L15 = SparkFun-Passives:INDUCTOR: Inductors Basic Inductor/Choke - 0603 and 1206. Footprints are not proven and vary greatly between part numbers.
LED_LL LED_LR LED_UL LED_UR = 00-EvaLibrary:LED_RGB
LINE_IN PHONE_OUT = 00-EvaLibrary:PHONE_SW
Q2 Q4 Q6 = SparkFun-DiscreteSemi:MOSFET-NCHANNEL: Generic NMOS footprint
R1-R42 = 00-EvaLibrary:R-US_: RESISTOR, American symbol
SD1 = 00-EvaLibrary:MICROSD
SERIAL = 00-EvaLibrary:HEADER-6X1
SMA = 00-EvaLibrary:SMA
U1 = 00-EvaLibrary:CC2591
U2 = 00-EvaLibrary:CC85XX
U3 = 00-EvaLibrary:CS4270
U4 = 00-EvaLibrary:LM4881
U5 = 00-EvaLibrary:MCP1826
U6 = 00-EvaLibrary:BQ2409X
U7 = 00-EvaLibrary:TLV700
U8 = 00-EvaLibrary:SN74LVC1G80
U9 = 00-EvaLibrary:CS2300
U10 = 00-EvaLibrary:AT32UC3A3
U11 = 00-EvaLibrary:AT42QT1110
U13 = 00-EvaLibrary:SDRAM-AS4CM16S
USB = 00-EvaLibrary:USB_MICRO_AB
X2 X3 = 00-EvaLibrary:OSCILLATOR

## Board
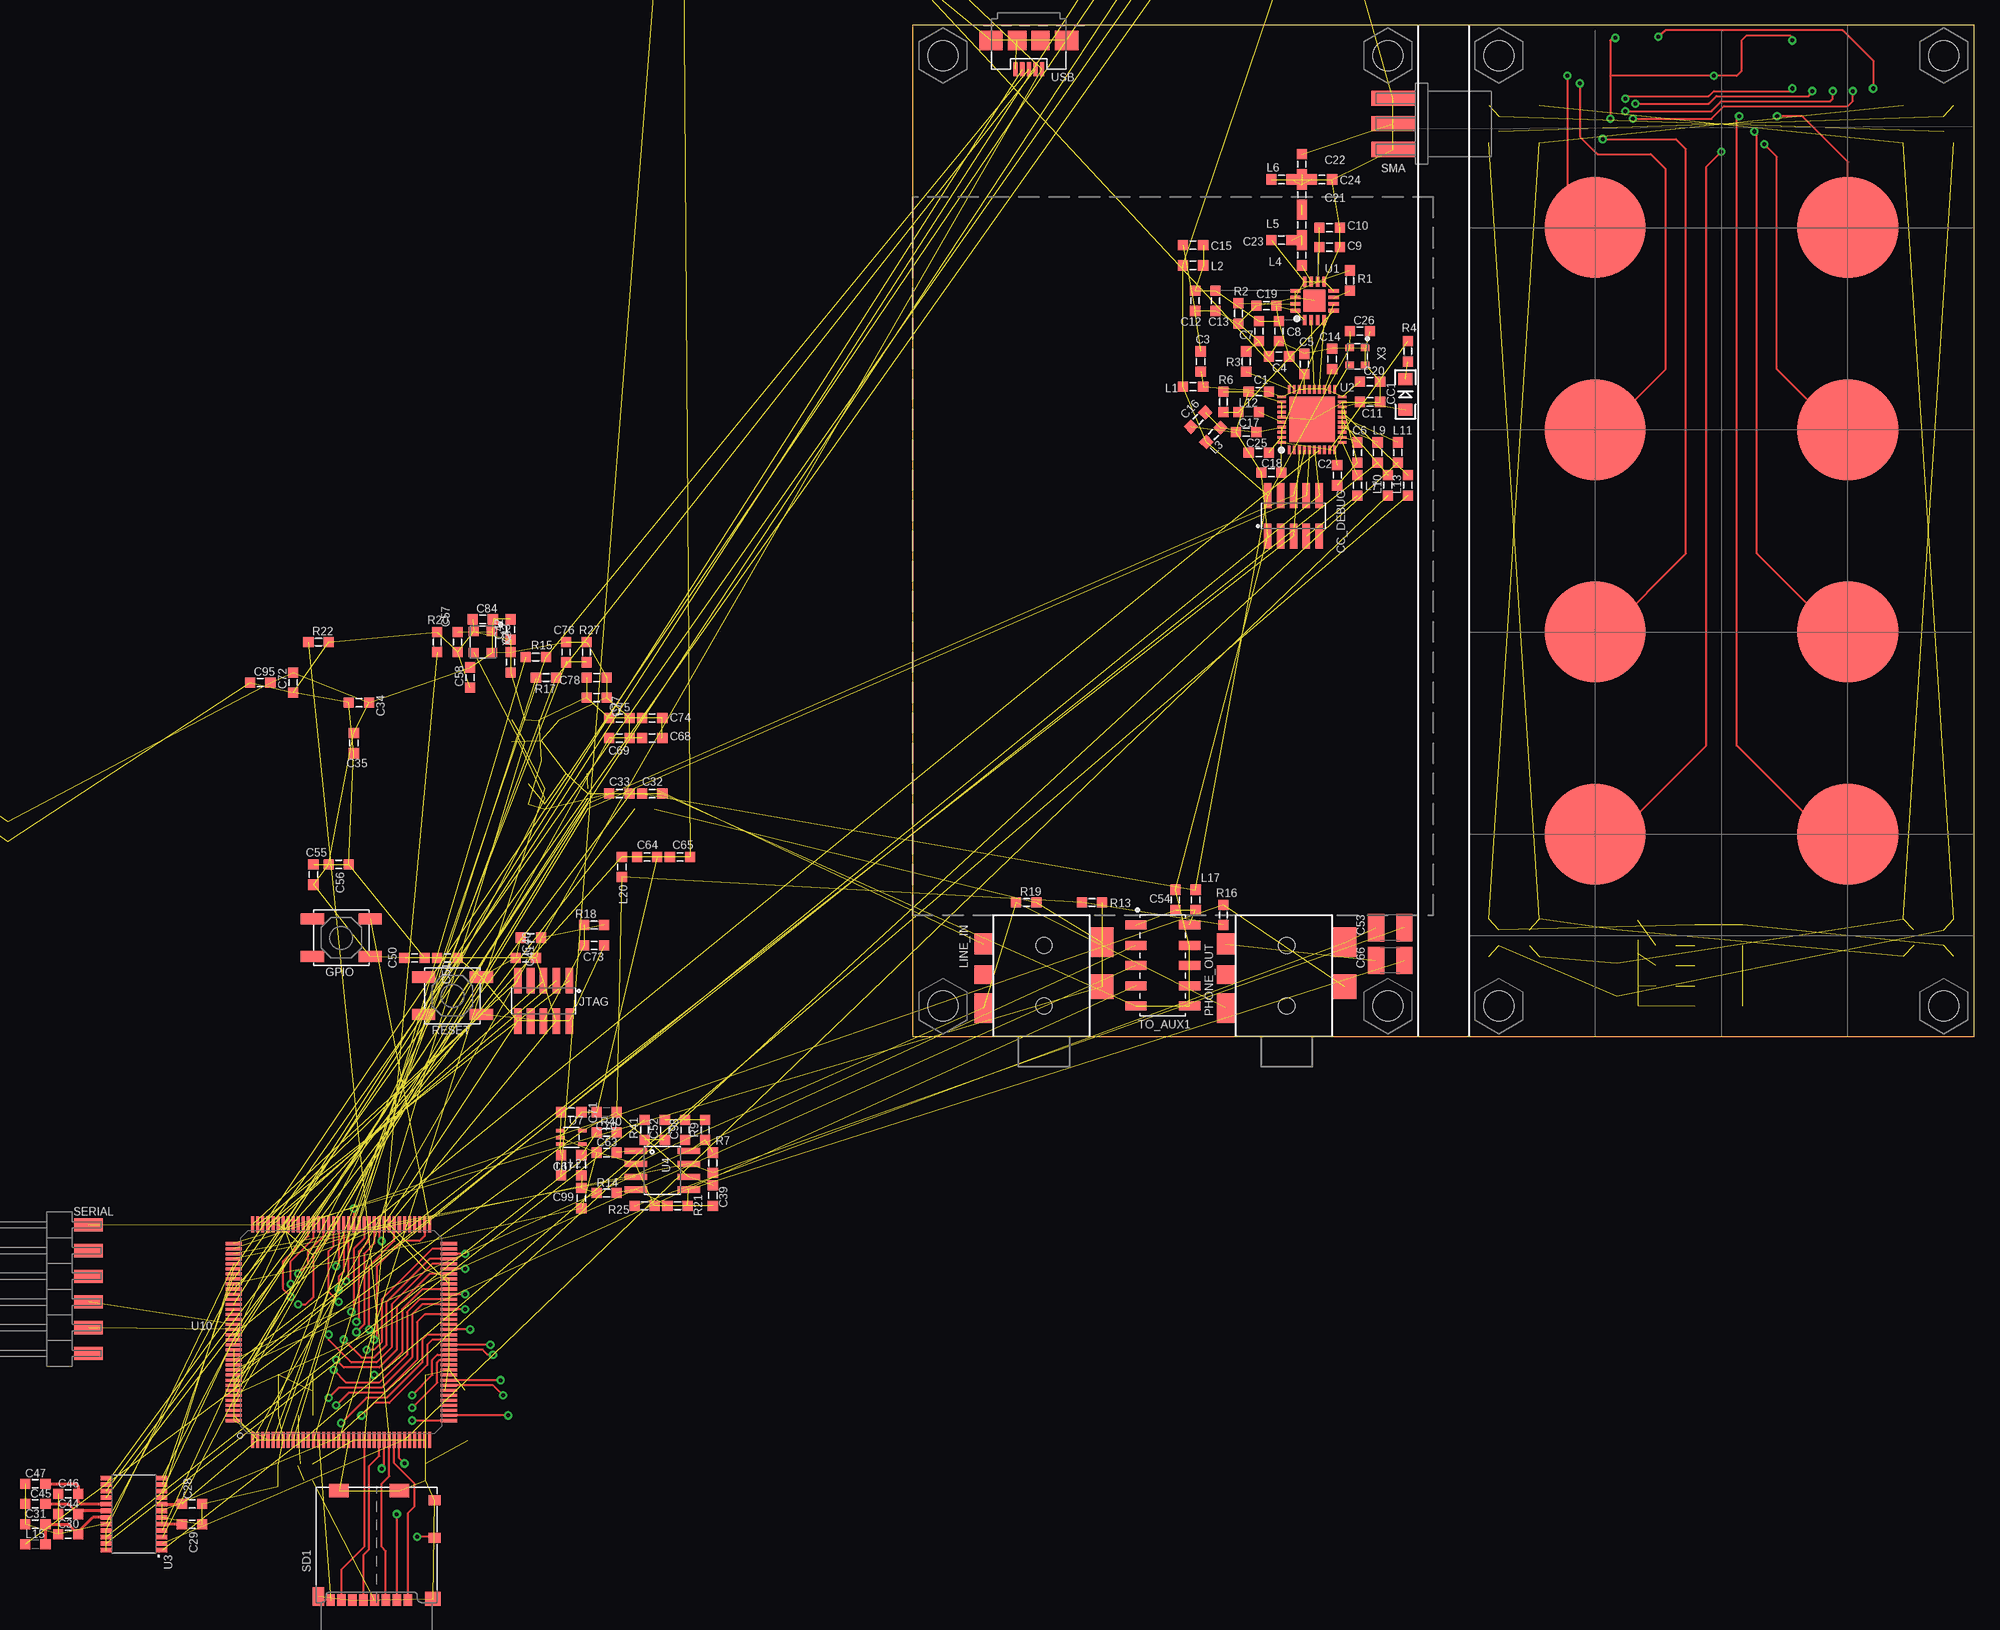
[diagram p5: board, top side]
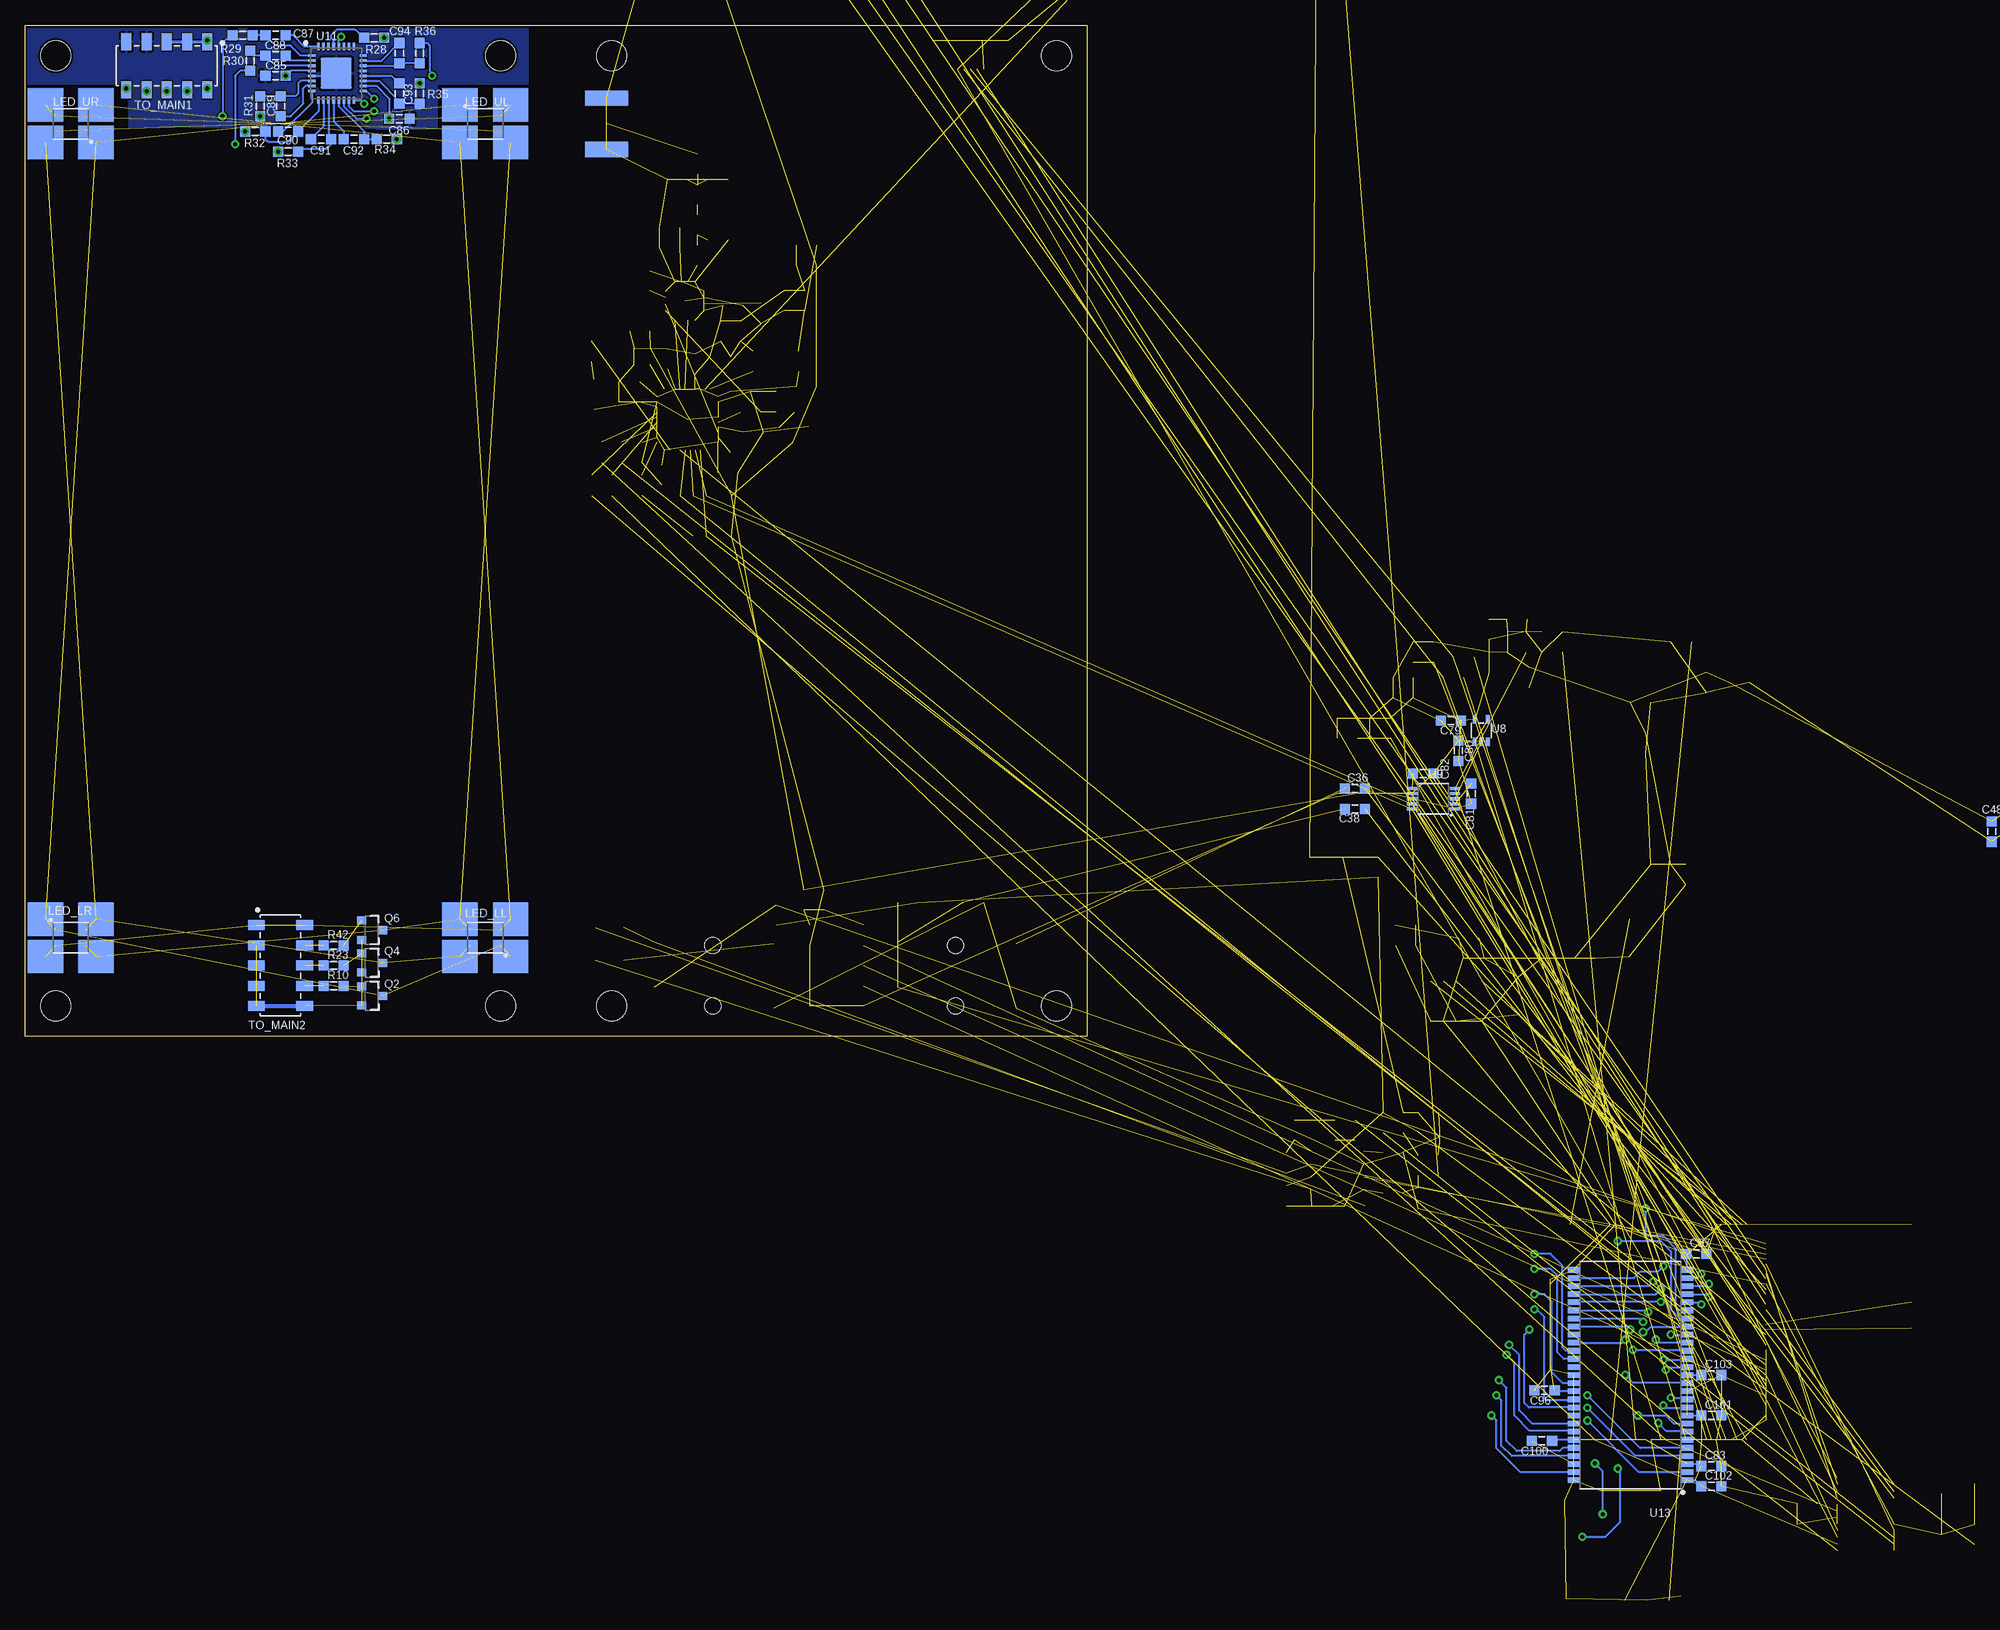
[diagram p6: board, bottom side, seen from below]

Size 105 x 100 mm. Coordinates in mm from the lower left corner, seen from the top.
Outline: 0,0 105,0 105,100 0,100 0,0
Copper layers (1+2*3+16): Top 0.034290625mm / dielectric 0.24891875mm / Route2 0.034290625mm / dielectric 39mil / Route3 0.034290625mm / dielectric 0.24891875mm / Bottom 0.034290625mm
Design rules "66each *": minimum track width 6mil, minimum drill 15mil, track to track 6mil, track to pad 6mil, pad to pad 6mil, via to via 6mil, smd to smd 0mil, copper to edge 10mil, drill to drill 10mil, minimum pad ring 10mil, minimum via ring 8mil, stop-mask expansion 4mil, vias tented up to drill 0mil, thermal gap 10mil
tRestrict: 2 lines

### Footprints (pad centres in the part's own frame; a part is rotated, then mirrored left to right if it is on the bottom)
LED-1206 = smd 1.2 x 1.4: A -1.5,0; C 1.5,0
1775469-2 = smd 1 x 3.5: + -1,-1.75; - 1,-1.75 | smd 1.5 x 3.4: X1 -3.25,3.8; X2 3.25,3.8
TOUCH-CIRCLE-10MM = smd 10 x 10: P$1 0,0
C0603 = smd 1 x 1: 1 -1,0; 2 1,0
C1210 = smd 1.6 x 2.7: 1 -1.4,0; 2 1.4,0
HEADER-10P-1.27MM = smd 0.75 x 2.5: 1 -2.54,-2; 2 -2.54,2; 3 -1.27,-2; 4 -1.27,2; 5 0,-2; 6 0,2; 7 1.27,-2; 8 1.27,2; 9 2.54,-2; 10 2.54,2
1210 = smd 1.2 x 2: 1 -1.6,0; 2 1.6,0
PTS-525 = smd 2.3 x 1.1: 1 -2.85,1.85; 2 2.85,1.85; 3 -2.85,-1.85; 4 2.85,-1.85
0603 = smd 1 x 1: 1 -1,0; 2 1,0
PLCC-4 = smd 1.5 x 1.1: 1 -1.5,0.75; 2 -1.5,-0.75; 3 1.5,-0.75; 4 1.5,0.75 | smd 3.5 x 3.3: 1-2 -2.5,1.85; 2-2 -2.5,-1.85; 3-2 2.5,-1.85; 4-2 2.5,1.85
STX-35332-5N = smd 1.75 x 2.1: 1 -6,9.15 | smd 1.75 x 1.8: 2 -6,6.1 | smd 2.25 x 2.4: 3 5.75,4.9 | smd 2.25 x 2.9: 4 5.75,9.3 | smd 1.75 x 2.9: 5 -6,2.8 | hole 1.6: 0,9; 0,3
SOT23-3 = smd 0.8 x 0.9: 1 -0.95,-1; 2 0.95,-1; 3 0,1.1
R0603 = smd 1 x 1: 1 -1,0; 2 1,0
MOLEX_104031-0811 = smd 0.85 x 1.1: CD/DAT3 2.005,0.25; CLK -1.295,0.25; CMD 0.905,0.25; DAT0 -3.495,0.25; DAT2 3.105,0.25; VDD -0.195,0.25; VSS -2.395,0.25 | smd 0.75 x 1.1: DAT1 -4.545,0.25 | smd 1.55 x 1.35: GND1 5.565,0.375 | smd 1.17 x 1.8: GND2 -5.755,0.6 | smd 1.9 x 1.35: GND3 -3.73,11.075; GND4 2.24,11.075 | smd 1.2 x 1: SWA 5.74,6.4; SWB 5.74,10.1
HEADER-3M-961-6P-2.54MM = smd 1.3 x 2.8: 1 -6.35,0; 2 -3.81,0; 3 -1.27,0; 4 1.27,0; 5 3.81,0; 6 6.35,0
CONREVSMA003.062 = smd 4.25 x 1.5 bottom: GND1 2.25,-2.54; GND3 2.25,2.54 | smd 4.25 x 1.5: GND2 2.25,-2.54; GND4 2.25,2.54; SIG 2.25,0
M22-63405 = smd 0.89 x 2.1: 1 -4,-2.65; 2 -4,2.65; 3 -2,-2.65; 4 -2,2.65; 5 0,-2.65; 6 0,2.65; 7 2,-2.65; 8 2,2.65; 9 4,-2.65; 10 4,2.65
M22-53205 = smd 1 x 1.65: 1 -4,-2.375; 2 -4,2.375; 3 -2,-2.375; 4 -2,2.375; 5 0,-2.375; 6 0,2.375; 7 2,-2.375; 8 2,2.375; 9 4,-2.375; 10 4,2.375
S-PVQFN-N16 = smd 1 x 0.35: 1 -1.9,0.975; 2 -1.9,0.325; 3 -1.9,-0.325; 4 -1.9,-0.975; 9 1.9,-0.975; 10 1.9,-0.325; 11 1.9,0.325; 12 1.9,0.975 | smd 0.35 x 1: 5 -0.975,-1.9; 6 -0.325,-1.9; 7 0.325,-1.9; 8 0.975,-1.9; 13 0.975,1.9; 14 0.325,1.9; 15 -0.325,1.9; 16 -0.975,1.9 | smd 2.16 x 2.16: GND 0,0
S-PVQFN-N40 = smd 0.85 x 0.28: 1 -3,2.25; 2 -3,1.75; 3 -3,1.25; 4 -3,0.75; 5 -3,0.25; 6 -3,-0.25; 7 -3,-0.75; 8 -3,-1.25; 9 -3,-1.75; 10 -3,-2.25; 21 3,-2.25; 22 3,-1.75; 23 3,-1.25; 24 3,-0.75; 25 3,-0.25; 26 3,0.25; 27 3,0.75; 28 3,1.25; 29 3,1.75; 30 3,2.25 | smd 0.28 x 0.85: 11 -2.25,-3; 12 -1.75,-3; 13 -1.25,-3; 14 -0.75,-3; 15 -0.25,-3; 16 0.25,-3; 17 0.75,-3; 18 1.25,-3; 19 1.75,-3; 20 2.25,-3; 31 2.25,3; 32 1.75,3; 33 1.25,3; 34 0.75,3; 35 0.25,3; 36 -0.25,3; 37 -0.75,3; 38 -1.25,3; 39 -1.75,3; 40 -2.25,3 | smd 4.5 x 4.5: GND 0,0
TSSOP-24L = smd 1.05 x 0.45: 1 -2.775,3.575; 2 -2.775,2.925; 3 -2.775,2.275; 4 -2.775,1.625; 5 -2.775,0.975; 6 -2.775,0.325; 7 -2.775,-0.325; 8 -2.775,-0.975; 9 -2.775,-1.625; 10 -2.775,-2.275; 11 -2.775,-2.925; 12 -2.775,-3.575; 13 2.775,-3.575; 14 2.775,-2.925; 15 2.775,-2.275; 16 2.775,-1.625; 17 2.775,-0.975; 18 2.775,-0.325; 19 2.775,0.325; 20 2.775,0.975; 21 2.775,1.625; 22 2.775,2.275; 23 2.775,2.925; 24 2.775,3.575
SO08 = smd 0.61 x 2.21: 1 -1.905,-2.616; 2 -0.635,-2.616; 3 0.635,-2.616; 4 1.905,-2.616; 5 1.905,2.616; 6 0.635,2.616; 7 -0.635,2.616; 8 -1.905,2.616
SOT-223 = smd 1.9 x 1.9: 1 -2.7,-3.1; 3 2.7,-3.1 | smd 1.1 x 1.9: 2 0,-3.1 | smd 6.7 x 1.9: 4 0,3.1
S-PDSO-G10 = smd 1.6 x 0.3: 1 -2.1,1; 2 -2.1,0.5; 3 -2.1,0; 4 -2.1,-0.5; 5 -2.1,-1; 6 2.1,-1; 7 2.1,-0.5; 8 2.1,0; 9 2.1,0.5; 10 2.1,1 | smd 1.57 x 1.88: GND 0,0
SOT-23-5 = smd 0.35 x 0.85: 1 -0.65,-1.1; 2 0,-1.1; 3 0.65,-1.1; 4 0.65,1.1; 5 -0.65,1.1
MSOP-10L = smd 1 x 0.305: 1 -2.125,1; 2 -2.125,0.5; 3 -2.125,0; 4 -2.125,-0.5; 5 -2.125,-1; 6 2.125,-1; 7 2.125,-0.5; 8 2.125,0; 9 2.125,0.5; 10 2.125,1
LQFP-144 = smd 1.6 x 0.3: 1 -10.65,8.75; 2 -10.65,8.25; 3 -10.65,7.75; 4 -10.65,7.25; 5 -10.65,6.75; 6 -10.65,6.25; 7 -10.65,5.75; 8 -10.65,5.25; 9 -10.65,4.75; 10 -10.65,4.25; 11 -10.65,3.75; 12 -10.65,3.25; 13 -10.65,2.75; 14 -10.65,2.25; 15 -10.65,1.75; 16 -10.65,1.25; 17 -10.65,0.75; 18 -10.65,0.25; 19 -10.65,-0.25; 20 -10.65,-0.75; 21 -10.65,-1.25; 22 -10.65,-1.75; 23 -10.65,-2.25; 24 -10.65,-2.75; 25 -10.65,-3.25; 26 -10.65,-3.75; 27 -10.65,-4.25; 28 -10.65,-4.75; 29 -10.65,-5.25; 30 -10.65,-5.75; 31 -10.65,-6.25; 32 -10.65,-6.75; 33 -10.65,-7.25; 34 -10.65,-7.75; 35 -10.65,-8.25; 36 -10.65,-8.75; 73 10.65,-8.75; 74 10.65,-8.25; 75 10.65,-7.75; 76 10.65,-7.25; 77 10.65,-6.75; 78 10.65,-6.25; 79 10.65,-5.75; 80 10.65,-5.25; 81 10.65,-4.75; 82 10.65,-4.25; 83 10.65,-3.75; 84 10.65,-3.25; 85 10.65,-2.75; 86 10.65,-2.25; 87 10.65,-1.75; 88 10.65,-1.25; 89 10.65,-0.75; 90 10.65,-0.25; 91 10.65,0.25; 92 10.65,0.75; 93 10.65,1.25; 94 10.65,1.75; 95 10.65,2.25; 96 10.65,2.75; 97 10.65,3.25; 98 10.65,3.75; 99 10.65,4.25; 100 10.65,4.75; 101 10.65,5.25; 102 10.65,5.75; 103 10.65,6.25; 104 10.65,6.75; 105 10.65,7.25; 106 10.65,7.75; 107 10.65,8.25; 108 10.65,8.75 | smd 0.3 x 1.6: 37 -8.75,-10.65; 38 -8.25,-10.65; 39 -7.75,-10.65; 40 -7.25,-10.65; 41 -6.75,-10.65; 42 -6.25,-10.65; 43 -5.75,-10.65; 44 -5.25,-10.65; 45 -4.75,-10.65; 46 -4.25,-10.65; 47 -3.75,-10.65; 48 -3.25,-10.65; 49 -2.75,-10.65; 50 -2.25,-10.65; 51 -1.75,-10.65; 52 -1.25,-10.65; 53 -0.75,-10.65; 54 -0.25,-10.65; 55 0.25,-10.65; 56 0.75,-10.65; 57 1.25,-10.65; 58 1.75,-10.65; 59 2.25,-10.65; 60 2.75,-10.65; 61 3.25,-10.65; 62 3.75,-10.65; 63 4.25,-10.65; 64 4.75,-10.65; 65 5.25,-10.65; 66 5.75,-10.65; 67 6.25,-10.65; 68 6.75,-10.65; 69 7.25,-10.65; 70 7.75,-10.65; 71 8.25,-10.65; 72 8.75,-10.65; 109 8.75,10.65; 110 8.25,10.65; 111 7.75,10.65; 112 7.25,10.65; 113 6.75,10.65; 114 6.25,10.65; 115 5.75,10.65; 116 5.25,10.65; 117 4.75,10.65; 118 4.25,10.65; 119 3.75,10.65; 120 3.25,10.65; 121 2.75,10.65; 122 2.25,10.65; 123 1.75,10.65; 124 1.25,10.65; 125 0.75,10.65; 126 0.25,10.65; 127 -0.25,10.65; 128 -0.75,10.65; 129 -1.25,10.65; 130 -1.75,10.65; 131 -2.25,10.65; 132 -2.75,10.65; 133 -3.25,10.65; 134 -3.75,10.65; 135 -4.25,10.65; 136 -4.75,10.65; 137 -5.25,10.65; 138 -5.75,10.65; 139 -6.25,10.65; 140 -6.75,10.65; 141 -7.25,10.65; 142 -7.75,10.65; 143 -8.25,10.65; 144 -8.75,10.65
QFN-32 = smd 0.7 x 0.25: 1 -2.4,1.75; 2 -2.4,1.25; 3 -2.4,0.75; 4 -2.4,0.25; 5 -2.4,-0.25; 6 -2.4,-0.75; 7 -2.4,-1.25; 8 -2.4,-1.75; 17 2.65,-1.75; 18 2.65,-1.25; 19 2.65,-0.75; 20 2.65,-0.25; 21 2.65,0.25; 22 2.65,0.75; 23 2.65,1.25; 24 2.65,1.75 | smd 0.25 x 0.7: 9 -1.75,-2.65; 10 -1.25,-2.65; 11 -0.75,-2.65; 12 -0.25,-2.65; 13 0.25,-2.65; 14 0.75,-2.65; 15 1.25,-2.65; 16 1.75,-2.65; 25 1.75,2.65; 26 1.25,2.65; 27 0.75,2.65; 28 0.25,2.65; 29 -0.25,2.65; 30 -0.75,2.65; 31 -1.25,2.65; 32 -1.75,2.65 | smd 3.1 x 3.1: GND 0,0
TSSOP-54 = smd 1.2 x 0.56: 1 -5.6,10.4; 2 -5.6,9.6; 3 -5.6,8.8; 4 -5.6,8; 5 -5.6,7.2; 6 -5.6,6.4; 7 -5.6,5.6; 8 -5.6,4.8; 9 -5.6,4; 10 -5.6,3.2; 11 -5.6,2.4; 12 -5.6,1.6; 13 -5.6,0.8; 14 -5.6,0; 15 -5.6,-0.8; 16 -5.6,-1.6; 17 -5.6,-2.4; 18 -5.6,-3.2; 19 -5.6,-4; 20 -5.6,-4.8; 21 -5.6,-5.6; 22 -5.6,-6.4; 23 -5.6,-7.2; 24 -5.6,-8; 25 -5.6,-8.8; 26 -5.6,-9.6; 27 -5.6,-10.4; 28 5.6,-10.4; 29 5.6,-9.6; 30 5.6,-8.8; 31 5.6,-8; 32 5.6,-7.2; 33 5.6,-6.4; 34 5.6,-5.6; 35 5.6,-4.8; 36 5.6,-4; 37 5.6,-3.2; 38 5.6,-2.4; 39 5.6,-1.6; 40 5.6,-0.8; 41 5.6,0; 42 5.6,0.8; 43 5.6,1.6; 44 5.6,2.4; 45 5.6,3.2; 46 5.6,4; 47 5.6,4.8; 48 5.6,5.6; 49 5.6,6.4; 50 5.6,7.2; 51 5.6,8; 52 5.6,8.8; 53 5.6,9.6; 54 5.6,10.4
STANDOFF_3/16 = hole 2.946: 0,0
USB_MICRO_AB = smd 0.4 x 1.4: 1 -1.3,2.85; 2 -0.65,2.85; 3 0,2.85; 4 0.65,2.85; 5 1.3,2.85 | smd 2.3 x 1.9: GND1 -3.75,0; GND4 3.75,0 | smd 1.8 x 1.9: GND2 -1.15,0; GND3 1.15,0
ASEMB = smd 0.9 x 1: 1 -1.05,0.9; 2 1.05,0.9; 3 1.05,-0.9; 4 -1.05,-0.9
ASDMB = smd 0.65 x 0.85: 1 -0.825,0.775; 2 0.825,0.775; 3 0.825,-0.775; 4 -0.825,-0.775

### Placement (x,y rotation side)
AVR  -124,47.25 90 top  (outside the outline)
AVR1  -124,58 270 top  (outside the outline)
BATTERY  -27,141.5 270 top  (outside the outline)
BUTTON  92.5,20 0 top
C1  34.25,63.75 180 top
C2  42,55.5 270 top
C3  28.5,66.75 90 top
C4  36.25,67.25 180 top
C5  38.75,66.5 90 top
C6  44,57.75 270 top
C7  34.25,69.75 270 top
C8  36.25,69.75 270 top
C9  41.25,78.05 0 top
C10  41.25,80 0 top
C11  45.25,62.75 0 top
C12  27.95,72.75 270 top
C13  29.95,72.75 270 top
C14  41.5,67 90 top
C15  27.75,78.25 180 top
C16  28.25,61 225 top
C17  33,59.75 180 top
C18  35.5,55.75 180 top
C19  35,72.25 180 top
C20  45.25,64.75 0 top
C21  38.5,83.25 90 top
C22  38.5,86.25 90 top
C23  36.5,78.75 180 top
C24  40.5,84.75 0 top
C25  34.25,57.75 180 top
C26  44.25,69.75 0 top
C28  -71.25,-46.25 0 top  (outside the outline)
C29  -71.25,-48.25 0 top  (outside the outline)
C30  -83.5,-49.25 180 top  (outside the outline)
C31  -86.75,-48.25 180 top  (outside the outline)
C32  -25.75,24 0 top  (outside the outline)
C33  -29,24 0 top  (outside the outline)
C34  -54.75,33 0 top  (outside the outline)
C35  -55.25,29 90 top  (outside the outline)
C36  -26.5,24.5 0 bottom  (outside the outline)
C38  -26.5,22.5 0 bottom  (outside the outline)
C39  -19.75,-15.75 270 top  (outside the outline)
C40  -38.25,7.75 180 top  (outside the outline)
C41  -37.75,9.75 180 top  (outside the outline)
C42  -39.75,40.25 90 top  (outside the outline)
C43  -39.75,37 90 top  (outside the outline)
C44  -83.5,-47.25 180 top  (outside the outline)
C45  -86.75,-46.25 180 top  (outside the outline)
C46  -83.5,-45.25 180 top  (outside the outline)
C47  -86.75,-44.25 180 top  (outside the outline)
C48  -89.5,20.25 90 bottom  (outside the outline)
C49  -121.5,44.75 270 top  (outside the outline)
C50  -49.25,7.75 180 top  (outside the outline)
C51  -46,7.75 0 top  (outside the outline)
C52  -24.5,-9.25 90 top  (outside the outline)
C53  47.25,10.75 180 top
C54  26,13.5 90 top
C55  -59.25,16 270 top  (outside the outline)
C56  -56.75,17 180 top  (outside the outline)
C57  -45,39 90 top  (outside the outline)
C58  -43.75,35.5 90 top  (outside the outline)
C59  -24.5,136 0 top  (outside the outline)
C60  -24.25,133.5 90 top  (outside the outline)
C61  -18.25,120.5 180 top  (outside the outline)
C62  40,120.25 270 top  (outside the outline)
C63  -30.25,-11.5 180 top  (outside the outline)
C64  -26.25,17.75 0 top  (outside the outline)
C65  -23,17.75 0 top  (outside the outline)
C66  47.25,7.5 180 top
C67  -32.75,-12.75 270 top  (outside the outline)
C68  -25.75,29.5 0 top  (outside the outline)
C69  -29,29.5 0 top  (outside the outline)
C70  10u  [C0603]  -30.25,-7.5 180 top  (outside the outline)
C71  -33.75,-7.5 0 top  (outside the outline)
C72  -61.25,35 90 top  (outside the outline)
C73  -31.5,9 0 top  (outside the outline)
C74  -25.75,31.5 0 top  (outside the outline)
C75  -29,31.5 0 top  (outside the outline)
C76  -34.25,38 90 top  (outside the outline)
C77  -31.25,33.5 0 top  (outside the outline)
C78  -31.25,35.5 0 top  (outside the outline)
C79  -36,31.25 180 bottom  (outside the outline)
C80  -36.75,28.25 90 bottom  (outside the outline)
C81  -38,24 90 bottom  (outside the outline)
C82  -33.25,26 0 bottom  (outside the outline)
C83  -61.75,-42.5 0 bottom  (outside the outline)
C84  -42.5,41.25 0 top  (outside the outline)
C85  80.25,95 180 bottom
C86  68,90.75 0 bottom
C87  80.25,99 180 bottom
C88  80.25,97 180 bottom
C89  79.75,92 90 bottom
C90  79,89.5 0 bottom
C91  75.75,88.75 0 bottom
C92  72.5,88.75 0 bottom
C93  68,93.25 270 bottom
C94  68,97.25 270 bottom
C95  -64.5,35 0 top  (outside the outline)
C96  -45.25,-35 180 bottom  (outside the outline)
C97  -60.25,-21.5 0 bottom  (outside the outline)
C98  -22.5,-9.25 270 top  (outside the outline)
C99  -32.75,-16 270 top  (outside the outline)
C100  -45,-40 180 bottom  (outside the outline)
C101  -61.75,-37.5 0 bottom  (outside the outline)
C102  -61.75,-44.5 0 bottom  (outside the outline)
C103  -61.75,-33.5 0 bottom  (outside the outline)
CC1  48.75,63.5 90 top
CC_DEBUG  37.68,51.48 0 top
CHARGE  -29.5,124.25 270 top  (outside the outline)
F1  -23.75,128.5 270 top  (outside the outline)
GPIO  -56.5,9.75 0 top  (outside the outline)
JTAG  -36.5,3.5 180 top  (outside the outline)
L1  27.75,64.25 180 top
L2  27.75,76.25 180 top
L3  29.75,59.5 225 top
L4  38.5,77.25 90 top
L5  38.5,80.25 90 top
L6  36.5,84.75 0 top
L7  44,54.5 270 top
L9  46,57.75 90 top
L10  47,54.5 90 top
L11  48,57.75 90 top
L12  6.8n  [0603]  33.25,61.75 180 top
L13  49,54.5 90 top
L15  BEAD  [0603]  -86.75,-50.25 180 top  (outside the outline)
L17  28,13.5 90 top
L19  39.75,115.75 270 top  (outside the outline)
L20  -28.75,16.75 270 top  (outside the outline)
L21  -34.75,-12.75 270 top  (outside the outline)
LED_LL  59.5,9.75 180 bottom
LED_LR  100.5,9.75 0 bottom
LED_UL  59.5,90.25 0 bottom
LED_UR  100.5,90.25 180 bottom
LINE_IN  13,0 0 top
NEXT  92.5,60 0 top
PHONE_OUT  37,0 0 top
PLAY/PAUSE  67.5,80 0 top
POWER  8.5,121.5 180 top  (outside the outline)
PREV  67.5,60 0 top
Q2  70.75,4 270 bottom
Q4  70.75,7.25 270 bottom
Q6  70.75,10.5 270 bottom
R1  43.25,74.75 90 top
R2  32.25,71.5 90 top
R3  33,66.75 270 top
R4  49,67.75 270 top
R5  -121.75,61.75 0 top  (outside the outline)
R6  30.75,62.75 270 top
R7  -19.75,-12.5 90 top  (outside the outline)
R8  -122.5,42.25 0 top  (outside the outline)
R9  -20.5,-9.25 90 top  (outside the outline)
R10  74.5,5 0 bottom
R11  -29.5,128.5 90 top  (outside the outline)
R12  14.5,120.75 0 top  (outside the outline)
R13  17.75,13.25 180 top
R14  -30.25,-15.5 180 top  (outside the outline)
R15  -37.25,37.5 0 top  (outside the outline)
R16  30.75,12 270 top
R17  -36.25,35.5 0 top  (outside the outline)
R18  -31.5,11 0 top  (outside the outline)
R19  11.25,13.25 0 top
R20  -47,39 90 top  (outside the outline)
R21  -23.25,-16.75 180 top  (outside the outline)
R22  -58.75,39 0 top  (outside the outline)
R23  74.5,7 0 bottom
R24  -22.75,121 270 top  (outside the outline)
R25  -26.5,-16.75 180 top  (outside the outline)
R26  -20.75,121 270 top  (outside the outline)
R27  -32.25,38 270 top  (outside the outline)
R28  70.5,98.75 0 bottom
R29  83.5,99 180 bottom
R30  82.75,96.5 270 bottom
R31  81.75,92 270 bottom
R32  82.25,89.5 180 bottom
R33  79,87.5 180 bottom
R34  69.25,88.75 0 bottom
R35  66,93.25 90 bottom
R36  66,97.25 90 bottom
R37  -25,125.25 180 top  (outside the outline)
R38  -27.25,135.75 270 top  (outside the outline)
R39  -29.25,135.75 270 top  (outside the outline)
R40  -30.25,-9.5 0 top  (outside the outline)
R41  -26.5,-9.25 90 top  (outside the outline)
R42  74.5,9 0 bottom
RESET  -45.5,4 180 top  (outside the outline)
SD1  -53,-56 0 top  (outside the outline)
SERIAL  -81.5,-25 90 top  (outside the outline)
SMA  49.75,90.25 180 top
STOP  92.5,80 0 top
TO_AUX1  24.75,7 270 top
TO_AUX2  28.75,118.25 0 top  (outside the outline)
TO_MAIN1  91,96 180 bottom
TO_MAIN2  79.75,7 270 bottom
U1  39.75,72.75 90 top
U2  39.5,61 90 top
U3  -77,-47.25 180 top  (outside the outline)
U4  -24.75,-13.25 270 top  (outside the outline)
U5  -15.5,125.42 270 top  (outside the outline)
U6  -27,130.5 270 top  (outside the outline)
U7  -33.75,-10 270 top  (outside the outline)
U8  -39,30.25 0 bottom  (outside the outline)
U9  -34.25,23.5 180 bottom  (outside the outline)
U10  -56.5,-29.25 90 top  (outside the outline)
U11  74.25,95.25 0 bottom
U13  -53.75,-33.5 180 bottom  (outside the outline)
U$1  [STANDOFF_3/16]  3,3 0 top
U$2  [STANDOFF_3/16]  47,3 0 top
U$3  [STANDOFF_3/16]  47,97 0 top
U$4  [STANDOFF_3/16]  3,97 0 top
U$5  [UBBP01]  0,12 0 top
U$6  [STANDOFF_3/16]  58,97 0 top
U$7  [STANDOFF_3/16]  102,97 0 top
U$8  [STANDOFF_3/16]  58,3 0 top
U$9  [STANDOFF_3/16]  102,3 0 top
USB  11.5,98.5 180 top
VOL+  92.5,40 0 top
VOL-  67.5,40 0 top
WIRELESS  67.5,20 0 top
X2  -42.5,39 270 top  (outside the outline)
X3  44,67.25 270 top

### Tracks (layer width: path | path; a pad name or v marks a point on that pad's centre or on a via)
12MHZ  (2 unrouted)
!CAS  (via drill 0.4)
  Top 0.2: U10.71 -47.5,-21 -52.5,-26 -52.5,-30.25 -53.25,-31 v-54,-31
  Bottom 0.2: v-54,-31 -59.25,-31 U13.17
!CHANGE  (1 unrouted)
!CS_CC8530  (2 unrouted)
!CS_CLOCK  (1 unrouted)
!CS_CODEC  (1 unrouted)
!CS_SDRAM  (via drill 0.4)
  Top 0.2: U10.68 -47.5,-22.5 -51.5,-26.5 -51.5,-30.75 -53,-32.25 -55.5,-32.25 -57.75,-30 v-57.75,-29.5
  Bottom 0.2: v-57.75,-29.5 U13.19
!CS_TOUCH  (1 unrouted)
!GPIO  (1 unrouted)
!MUTE  (2 unrouted)
!PAIR  (1 unrouted)
!RAS  (via drill 0.4)
  Top 0.2: U10.69 -47.75,-22 -52,-26.25 -52,-30.5 -53.25,-31.75 -54.5,-31.75 v-56.25,-30
  Bottom 0.2: U13.18 -56.55,-30.3 v-56.25,-30
!RESET  (4 unrouted)
!RESET_CC8530  (1 unrouted)
!RESET_CODEC  (1 unrouted)
!SD_CARD  (via drill 0.4)
  Top 0.2: SD1.SWA -47.5,-49.5 v-49,-49.5 | v-52.5,-42.75 -52.25,-42.5 U10.27
  Bottom 0.2: v-49,-49.5 -51.25,-49.5 -52.75,-48 -52.75,-43 v-52.5,-42.75
!WE_SDRAM  (via drill 0.4)
  Top 0.2: U10.66 -47.75,-23.5 -51,-26.75 -51,-31 -52.75,-32.75 -56.25,-32.75 v-57,-32
  Bottom 0.2: v-57,-32 -59.25,-32 U13.16
A0  (via drill 0.4)
  Top 0.2: v-60.75,-26.5 -60,-26.5 -59.25,-25.75 -59.25,-21.5 -57.75,-20 U10.93
  Bottom 0.2: U13.23 -60.55,-26.3 v-60.75,-26.5
A1  (via drill 0.4)
  Top 0.2: v-61.5,-25.75 -62.25,-25 -62.25,-22.25 -59.75,-19.75 U10.97
  Bottom 0.2: U13.24 -61.25,-25.5 v-61.5,-25.75
A2  (via drill 0.4)
  Top 0.2: v-61.5,-24.5 -61.5,-22.25 -59.25,-20 U10.96
  Bottom 0.2: U13.25 -61.3,-24.7 v-61.5,-24.5
A3  (via drill 0.4)
  Top 0.2: v-60.75,-23.5 -59.75,-22.5 -59.75,-21.25 -58.25,-19.75 U10.94
  Bottom 0.2: U13.26 -60.35,-23.9 v-60.75,-23.5
A3.3V  (7 unrouted)
A4  (via drill 0.4)
  Top 0.2: U10.91 -56.75,-22.5 v-57,-22.75
  Bottom 0.2: U13.29 -54.1,-23.9 -54.75,-23.25 -56.5,-23.25 v-57,-22.75
A5  (via drill 0.4)
  Top 0.2: v-56,-24.25 -55.75,-24 U10.89
  Bottom 0.2: U13.30 -55.55,-24.7 v-56,-24.25
A6  (via drill 0.4)
  Top 0.2: U10.90 -56.25,-23.25 -56.75,-23.75 v-56.75,-25
  Bottom 0.2: U13.31 -56.25,-25.5 v-56.75,-25
A7  (via drill 0.4)
  Top 0.2: v-56.75,-26.25 -57.75,-25.25 -57.75,-21.25 -57.25,-20.75 U10.92
  Bottom 0.2: v-56.75,-26.25 -48.2,-26.25 U13.32
A8  (via drill 0.4)
  Top 0.2: U10.86 -54.25,-20 -55.25,-21 -55.25,-27 v-55.5,-27.25
  Bottom 0.2: U13.33 -55.35,-27.1 v-55.5,-27.25
A9  (via drill 0.4)
  Top 0.2: v-55,-28.25 -54.75,-28 -54.75,-21.25 -53.75,-20.25 U10.85
  Bottom 0.2: U13.34 -54.65,-27.9 v-55,-28.25
A10  (via drill 0.4)
  Top 0.2: v-55.25,-17 U10.88
  Bottom 0.2: U13.22 -58.6,-27.1 -58.25,-26.75 -58.25,-21 -57,-19.75 -55.5,-19.75 -55.25,-19.5 v-55.25,-17
A11  (via drill 0.4)
  Top 0.2: U10.80 -51.25,-20.25 -53.75,-22.75 v-53.75,-29
  Bottom 0.2: U13.35 -53.45,-28.7 v-53.75,-29
AGND  (22 unrouted)
ALL_GND  (17 unrouted)
AUDIO  (3 unrouted)
AUX_!CHANGE  (via drill 0.4)
  Top 0.2: v95,93.75 95,96.5 92,99.5 74.5,99.5 v73.75,98.85
  Bottom 0.2: U11.28 74,98.5 v73.75,98.85 | v95,93.75 TO_MAIN1.10
AUX_BLUE  (1 unrouted)
AUX_CS  (via drill 0.4)
  Top 0.2: v71.25,90.75 79,90.75 80.25,92 92.5,92 93,92.5 v93,93.5
  Bottom 0.2: U11.14 73.5,92 72.25,90.75 v71.25,90.75 | v93,93.5 TO_MAIN1.8
AUX_GREEN  (1 unrouted)
AUX_MISO  (via drill 0.4)
  Top 0.2: v71.5,92.25 78.75,92.25 79.5,93 88.62,93 89,93.38 v89,93.5
  Bottom 0.2: U11.16 71.85,92.6 v71.5,92.25 | v89,93.5 TO_MAIN1.4
AUX_MOSI  (via drill 0.4)
  Top 0.2: v70.5,91.5 79,91.5 80,92.5 90.75,92.5 91,92.75 v91,93.5
  Bottom 0.2: U11.15 73,92 72.5,91.5 v70.5,91.5 | v91,93.5 TO_MAIN1.6
AUX_RED  (1 unrouted)
AUX_SCLK  (via drill 0.4)
  Top 0.2: v70.5,92.75 70.75,93 78.75,93 79.25,93.5 86.88,93.5 TO_MAIN1.2 v87,93.75
  Bottom 0.2: U11.17 71.25,93.5 v70.5,92.75 | v87,93.75 TO_MAIN1.2
AUX_VDD  (via drill 0.4)
  Top 0.2: v87,98.5 87,98.75 86.75,99 82.5,99 82,98.5 82,95.5 81.5,95 C85.1 69,95 | R28.2 69.25,98.75 69,98.5 69,95 | 69,95 C86.1
  Bottom 0.2: v87,98.5 TO_MAIN1.1 | U11.18 70.25,94 69,92.75 C86.1 | U11.4 78.75,95.5 C85.1
  Bottom 0.3: TO_MAIN1.5 TO_MAIN1.3 87.12,98.38 v87,98.5
  other vias: 69,90.75 69.5,98.75 79.25,95
AUX_VDD2  (7 unrouted)
  Bottom 0.2: 98,92.25 LED_UR.2-2 98,92 LED_UR.2
  Bottom 0.3: LED_UL.2 61,89.4 LED_UL.2-2
AUX_VSS
  Bottom 0.2: U11.5 74.5,95 U11.GND
  pour Bottom: 55.25,100 105,100 105,94.25 94.75,94.25 94.75,90 64.25,89.75 64.25,94.25 55.25,94.25
AUX_VSS1  (6 unrouted)
  Bottom 0.4: TO_MAIN2.9 TO_MAIN2.10
AVDD  (26 unrouted)
AVDD_AVR  (3 unrouted)
AVDD_CODEC
  Top 0.3: U3.19 -81.08,-47.58 -82.5,-49 C30.1 -83.5,-48.25 C31.1 L15.1
BA0  (via drill 0.4)
  Top 0.2: U10.84 -53.25,-20.5 -54.25,-21.5 -54.25,-28.5 v-55,-29.25
  Bottom 0.2: v-55,-29.25 -55.25,-29.25 -55.75,-28.75 -59.3,-28.75 U13.20
BA1  (via drill 0.4)
  Top 0.2: U10.83 -52.75,-20 v-52.5,-20.25
  Bottom 0.2: v-52.5,-20.25 -56.75,-20.25 -57.75,-21.25 -57.75,-27 -58.65,-27.9 U13.21
BAT  (5 unrouted)
BCLK  (2 unrouted)
BLUE  (1 unrouted)
CKE  (via drill 0.4)
  Top 0.2: U10.74 -48.25,-19.75 -48.75,-20.25 -50.5,-20.25 -53,-22.75 -53,-29.75 v-53.25,-30
  Bottom 0.2: U13.37 -52.95,-30.3 v-53.25,-30
CLK  (via drill 0.4)
  Top 0.2: v-44.25,-21.5 U10.70
  Bottom 0.2: U13.38 -47.35,-31.1 -47,-30.75 -47,-22.65 U10.70 v-44.25,-21.5
D0  (via drill 0.4)
  Top 0.2: v-49.5,-38 U10.37
  Bottom 0.2: U13.2 -54.6,-43.1 v-49.5,-38
D1  (via drill 0.4)
  Top 0.2: v-49.5,-36.75 -47,-34.25 -47,-32.25 -46.75,-32 U10.49
  Bottom 0.2: U13.4 -54.25,-41.5 v-49.5,-36.75
D2  (via drill 0.4)
  Top 0.2: v-49.5,-35.5 -47.5,-33.5 -47.5,-32 -47,-31.5 U10.50
  Bottom 0.2: U13.5 -54.7,-40.7 v-49.5,-35.5
D3  (via drill 0.4)
  Top 0.2: U10.54 -48,-29.5 -48.5,-30 -48.5,-32.25 -52,-35.75 -54,-35.75 v-56.5,-38.25
  Bottom 0.2: v-56.5,-38.25 -57.25,-39 -59.25,-39 U13.7
D3.3V  (65 unrouted)
  Top 0.3: U3.5 -72.28,-48.23 C29.1 | U3.8 -72.28,-46.27 C28.1
  Bottom 0.2: U13.43 -46.35,-35.1 C96.1 | U13.49 -46.1,-39.9 C100.1 | U13.9 C101.1 | U13.14 C103.1 | U13.3 -60.55,-42.3 C83.1 | U13.1 -60.15,-43.9 C102.1 | U13.27 -59.35,-21.6 C97.1
D4  (via drill 0.4)
  Top 0.2: U10.53 -47.5,-30 -48,-30.5 -48,-32.5 -51.75,-36.25 -53.25,-36.25 v-54.5,-37.5
  Bottom 0.2: v-54.5,-37.5 -57.25,-37.5 -58,-38.25 -59.3,-38.25 U13.8
D5  (via drill 0.4)
  Top 0.2: U10.58 -48.25,-27.5 -49,-28.25 -49,-32 -52.25,-35.25 -55.75,-35.25 v-57,-36.5
  Bottom 0.2: v-57,-36.5 -57.25,-36.75 -59.3,-36.75 U13.10
D6  (via drill 0.4)
  Top 0.2: U10.60 -48.5,-26.5 -49.5,-27.5 -49.5,-31.75 -52.5,-34.75 -56.75,-34.75 v-57.75,-35.75
  Bottom 0.2: v-57.75,-35.75 -59.2,-35.75 U13.11
D7  (via drill 0.4)
  Top 0.2: U10.63 -48.5,-25 -50.5,-27 -50.5,-31.25 -52.75,-33.5 v-53.25,-33.5
  Bottom 0.2: U13.13 -59.3,-34.25 -54,-34.25 v-53.25,-33.5
D8  (via drill 0.4)
  Top 0.2: v-44.25,-25.5 U10.62
  Bottom 0.2: U13.42 -47.05,-34.3 -46,-33.25 -46,-26.25 -45.25,-25.5 v-44.25,-25.5
D9  (via drill 0.4)
  Top 0.2: v-44.25,-27 U10.59
  Bottom 0.2: U13.44 -47.6,-35.9 -47.5,-36 -45.5,-36 -45.25,-35.75 -45.25,-27.75 -44.5,-27 v-44.25,-27
D10  (via drill 0.4)
  Top 0.2: v-43.75,-29 U10.55
  Bottom 0.2: U13.45 -43.7,-36.7 -43.25,-36.25 -43.25,-29.5 v-43.75,-29
D11  (via drill 0.4)
  Top 0.2: v-41.75,-30.5 U10.52
  Bottom 0.2: U13.47 -44.05,-38.3 -42.75,-37 -42.75,-31.5 v-41.75,-30.5
D12  (via drill 0.4)
  Top 0.2: v-41.5,-31.5 -42,-31.5 -42.5,-31 U10.51
  Bottom 0.2: v-41.5,-31.5 -42.25,-32.25 -42.25,-37.5 -43.75,-39 -47.75,-39 -47.85,-39.1 U13.48
D13  (via drill 0.4)
  Top 0.2: v-40.75,-34 U10.45
  Bottom 0.2: U13.50 -47.05,-40.7 -46.75,-41 -42.5,-41 -41.5,-40 -41.5,-34.75 v-40.75,-34
D14  (via drill 0.4)
  Top 0.2: v-40.5,-35.5 -41.5,-34.5 U10.44
  Bottom 0.2: U13.51 -42,-41.5 -41,-40.5 -41,-36 v-40.5,-35.5
D15  (via drill 0.4)
  Top 0.2: v-40,-37.5 U10.38
  Bottom 0.2: U13.53 -42.85,-43.1 -40.5,-40.75 -40.5,-38 v-40,-37.5
D+_UC  (2 unrouted)
D-_UC  (2 unrouted)
DGND  (135 unrouted)
DIN  (2 unrouted)
DOUT  (2 unrouted)
GREEN  (1 unrouted)
IN_L  (2 unrouted)
IN_R  (1 unrouted)
IOVDD  (12 unrouted)
LDQM  (via drill 0.4)
  Top 0.2: U10.61 -48.75,-26 -50,-27.25 -50,-31.5 -52.75,-34.25 -56,-34.25 v-57.25,-33
  Bottom 0.2: v-57.25,-33 -57.5,-32.75 -59.3,-32.75 U13.15
LINEIN_SENSE  (2 unrouted)
LNA_EN  (1 unrouted)
MCI-CLK
  Top 0.2: SD1.CLK -54.3,-51.3 -53.75,-50.75 -53.75,-42.5 -52.75,-41.5 U10.26
MCI-CMD  (1 unrouted)
  Top 0.2: SD1.CMD -52.09,-50.91 -52.5,-50.5 -52.5,-44.25 -51.75,-43.5 U10.28
MCI-DATA0  (1 unrouted)
  Top 0.2: U10.23 -54.25,-50.5 -56.5,-52.75 -56.5,-55.99 SD1.DAT0
MCI-DATA1  (1 unrouted)
MCI-DATA2
  Top 0.2: SD1.DAT2 -49.9,-47.15 -49.25,-46.5 -49.25,-44.25 -51.25,-42.25 U10.29
MCI-DATA3  (via drill 0.4)
  Top 0.2: SD1.CD/DAT3 v-50.99,-47.26 v-51,-47.25 | v-50.25,-42.25 -50.75,-41.75 U10.30
  Bottom 0.2: v-51,-47.25 -51,-43 v-50.25,-42.25
MCLK  (2 unrouted)
MISO0  (2 unrouted)
MISO1  (2 unrouted)
MOSI0  (3 unrouted)
MOSI1  (2 unrouted)
N$1  (1 unrouted)
N$2  (1 unrouted)
N$3  (1 unrouted)
N$4  (1 unrouted)
N$5  (1 unrouted)
N$6
  Bottom 0.2: R36.1 C94.2 68.25,96 U11.22
N$7  (1 unrouted)
N$8  (1 unrouted)
N$9  (1 unrouted)
N$10  (1 unrouted)
N$11  (via drill 0.4)
  Top 0.2: 64.75,83 PLAY/PAUSE.P$1 64.75,82.75 v64.75,95
  Bottom 0.2: R36.2 65.25,98.25 65,98 65,95.5 v64.75,95
N$12  (1 unrouted)
N$13  (1 unrouted)
N$14  (2 unrouted)
N$15  (1 unrouted)
N$16  (3 unrouted)
N$17
  Bottom 0.2: U11.23 69.75,96.5 C94.1
N$18  (1 unrouted)
N$19  (1 unrouted)
N$20  (2 unrouted)
N$21  (1 unrouted)
N$22  (3 unrouted)
N$23  (1 unrouted)
N$24  (2 unrouted)
N$25  (1 unrouted)
N$26  (1 unrouted)
N$27  (1 unrouted)
N$28  (1 unrouted)
N$29  (1 unrouted)
N$30
  Bottom 0.2: R32.1 81.25,88.75 81,88.5 79,88.5 C90.2 76,91.5 U11.9
N$31  (1 unrouted)
N$32  (1 unrouted)
N$33  (1 unrouted)
N$34  (2 unrouted)
N$35  (1 unrouted)
N$39  (1 unrouted)
N$40  (2 unrouted)
N$41
  Bottom 0.2: R33.1 77.75,87.75 75.25,87.75 74.75,88.25 C91.2 75,89 U11.11
N$42
  Bottom 0.2: R34.1 C92.2 71.5,89.5 74,92 U11.13
N$43
  Bottom 0.2: R29.1 C87.2 80.25,98 78.75,98 77.75,97 U11.1
N$44  (1 unrouted)
N$45
  Bottom 0.2: R30.1 82.25,97 C88.2 80.25,96 U11.3
N$46  (1 unrouted)
N$47  (2 unrouted)
N$49  (1 unrouted)
N$50  (2 unrouted)
N$51  (1 unrouted)
N$53  (2 unrouted)
N$54  (2 unrouted)
N$56  (6 unrouted)
  Bottom 0.3: LED_UR.1 99,89.4 LED_UR.1-2 | LED_UL.1 61,91.1 LED_UL.1-2
N$58  (7 unrouted)
  Bottom 0.3: LED_UR.4 102,89.4 LED_UR.4-2
N$59
  Bottom 0.2: U11.32 77.4,97.9 78.5,99 C87.1
N$60
  Bottom 0.2: U11.8 76.65,92.35 79.5,89.5 C90.1
N$61  (via drill 0.4)
  Top 0.2: VOL+.P$1 91.25,40 83.5,47.75 83.5,89.25 R32.2
  other vias: 83.25,89.5
N$62
  Bottom 0.2: U11.10 75.5,90 C91.1
N$63  (via drill 0.4)
  Top 0.2: WIRELESS.P$1 69.75,20 78.5,28.75 78.5,86 R33.2
  other vias: 80,87.5
N$64
  Bottom 0.2: U11.12 74.5,90.5 73.5,89.5 C92.1
N$65  (via drill 0.4)
  Top 0.2: R34.2 75.5,88.75 76.5,87.75 76.5,47.75 68.75,40 VOL-.P$1
  other vias: 68.25,88.75
N$66  (1 unrouted)
N$67  (3 unrouted)
N$69  (1 unrouted)
N$71
  Bottom 0.2: R35.1 C93.2 68,92.5 70,94.5 U11.19
N$72  (via drill 0.4)
  Top 0.2: R35.2 66,89 67.75,87.25 73,87.25 74.5,85.75 74.5,66 68.5,60 PREV.P$1
  other vias: 66,94.25
N$76
  Bottom 0.2: U11.20 68.75,95 C93.1
N$77
  Bottom 0.2: U11.29 74.5,98.5 74.75,98.75 74.75,99 74.15,99.6 72.35,99.6 R28.1
N$78  (7 unrouted)
  Bottom 0.3: LED_UL.3 58,89.4 LED_UL.3-2
N$84  (3 unrouted)
N$85  (via drill 0.4)
  Top 0.2: STOP.P$1 92.5,86.5 88,91 v85.5,91
  Bottom 0.2: R29.2 85.25,98.5 85.5,98.25 v85.5,91
N$86
  Bottom 0.2: U11.2 78.75,96.5 C88.1
N$87  (via drill 0.4)
  Top 0.2: NEXT.P$1 91.5,60 85.5,66 85.5,87 v84.25,88.25
  Bottom 0.2: R30.2 83.75,95.5 84.25,95 v84.25,88.25
N$88
  Top 0.3: U3.17 -82.22,-46.27 -82.5,-46 C46.1 -82.5,-44.5 -82.75,-44.25 C47.1
N$89
  Top 0.3: U3.18 -82.17,-46.92 C44.1 -83.5,-46.25 C45.1
N$90
  Bottom 0.2: R31.1 C89.2 78.25,93 78,93.25 78,94.25 77.75,94.5 U11.6
N$91  (1 unrouted)
N$92  (1 unrouted)
N$93
  Bottom 0.2: U11.7 77.25,94 77.5,93.75 77.5,92.25 78.75,91 C89.1
N$94  (1 unrouted)
N$95  (via drill 0.4)
  Top 0.2: BUTTON.P$1 90.25,20 81.5,28.75 81.5,90.75 R31.2
  other vias: 81.75,91
OUT_L  (1 unrouted)
OUT_R  (1 unrouted)
PA_EN  (2 unrouted)
PHONE_L  (2 unrouted)
PHONE_R  (1 unrouted)
PHONE_SENSE  (2 unrouted)
RED  (1 unrouted)
RF_N  (1 unrouted)
RF_P  (1 unrouted)
RXD  (1 unrouted)
SCLK0  (3 unrouted)
SCLK1  (2 unrouted)
SHDN  (1 unrouted)
TCK  (1 unrouted)
TDI  (1 unrouted)
TDO  (1 unrouted)
TMS  (1 unrouted)
TXD  (1 unrouted)
UC_MCLK  (2 unrouted)
UDQM  (via drill 0.4)
  Top 0.2: v-44.25,-23 U10.67
  Bottom 0.2: U13.39 -47.15,-31.9 -46.5,-31.25 -46.5,-23.65 U10.67 v-44.25,-23
USBOTGID  (1 unrouted)
VBUS  (3 unrouted)
WCLK  (2 unrouted)